# EAGLE board smoothieboard-5driver (EAGLE 6.4), part 1 of 3
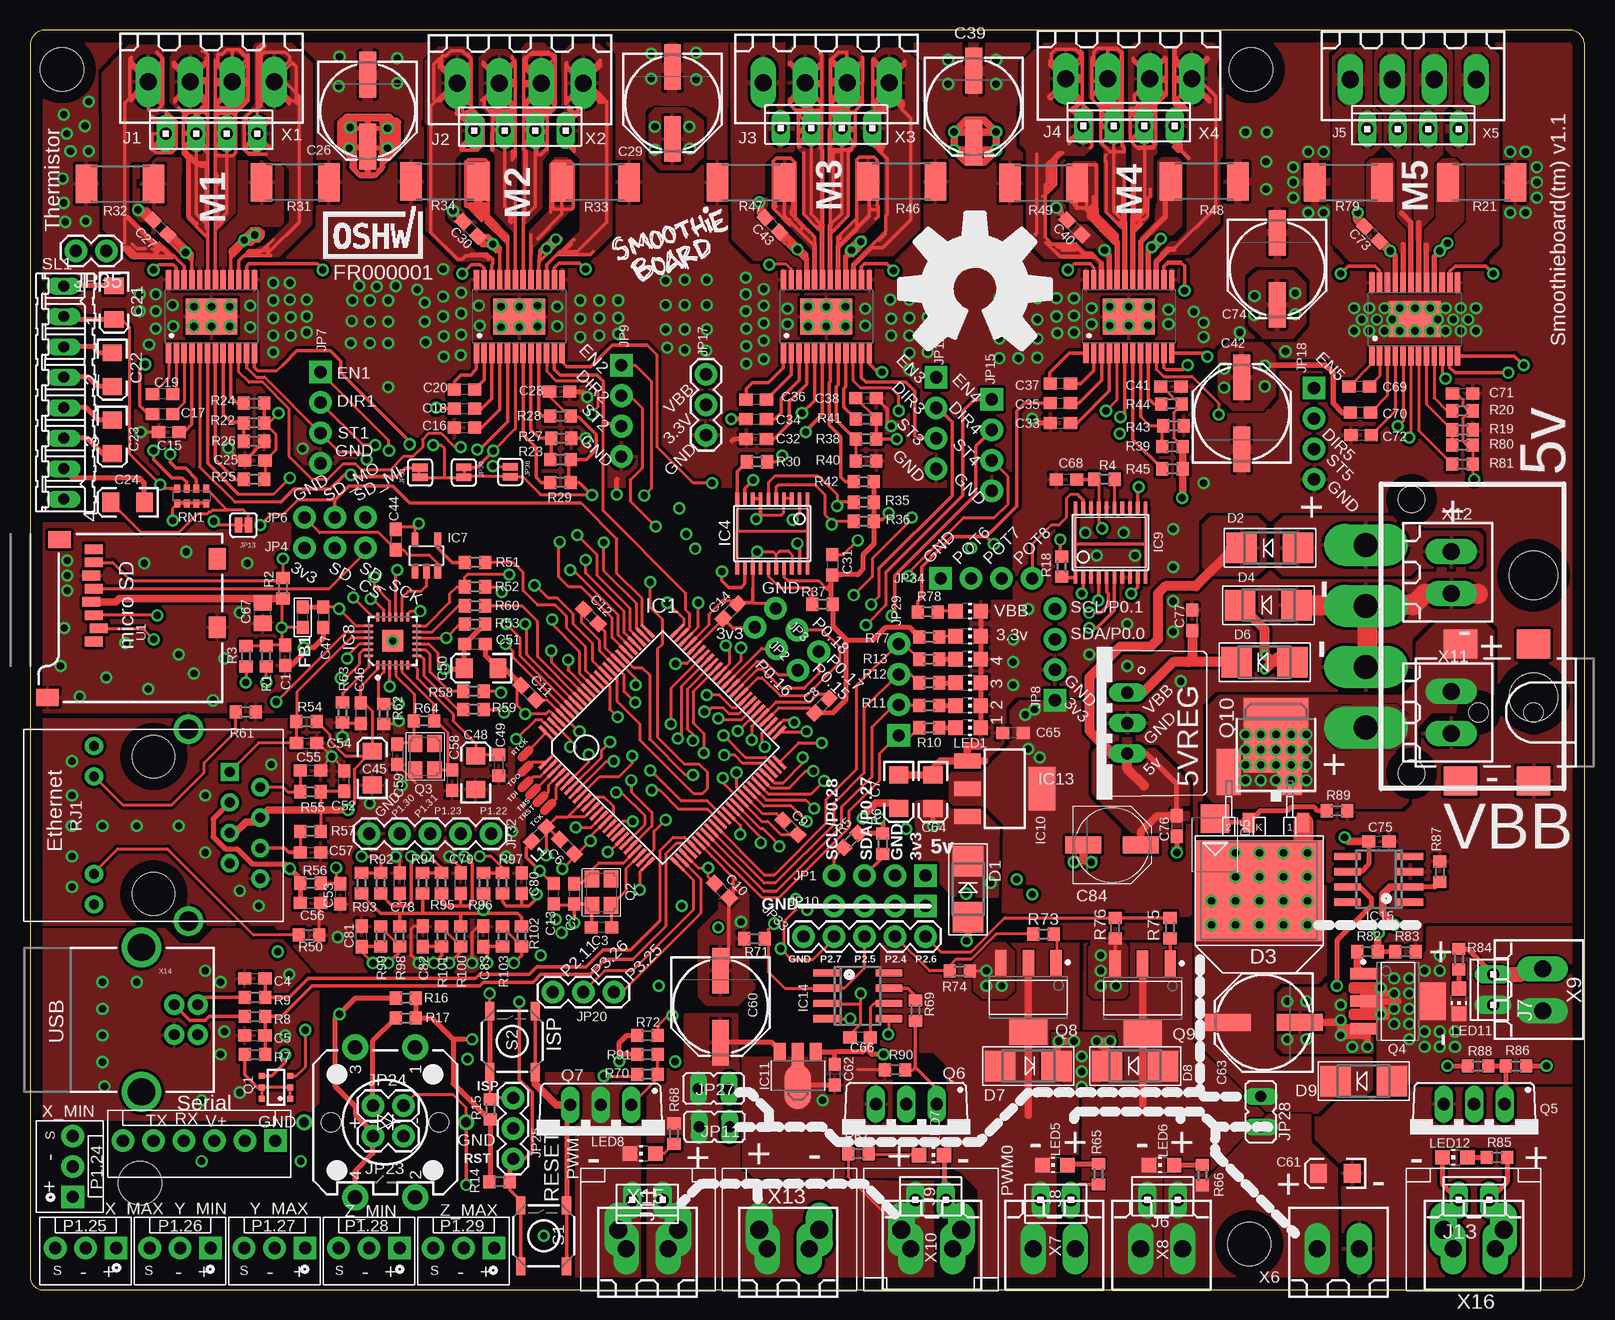
[diagram p4: board, top side]
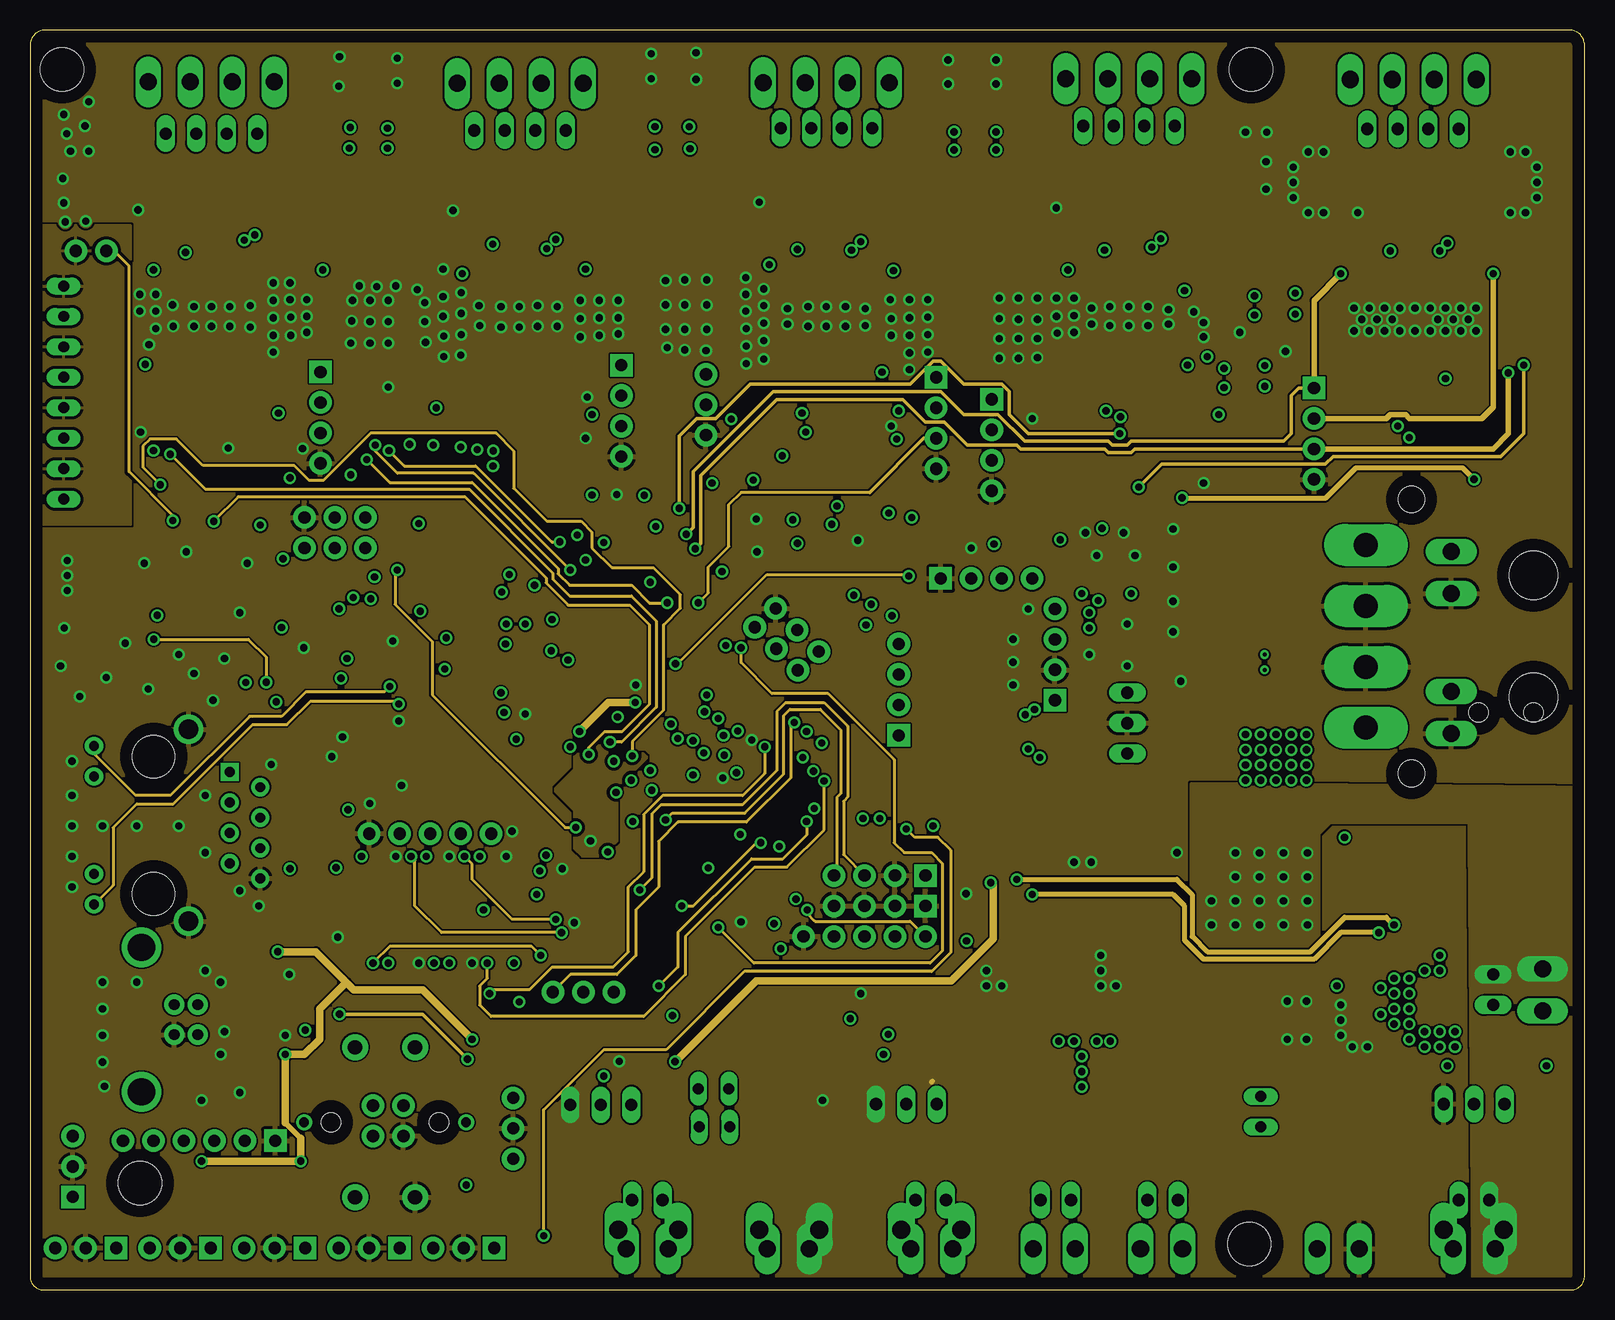
[diagram p5: board, inner layer Route2]
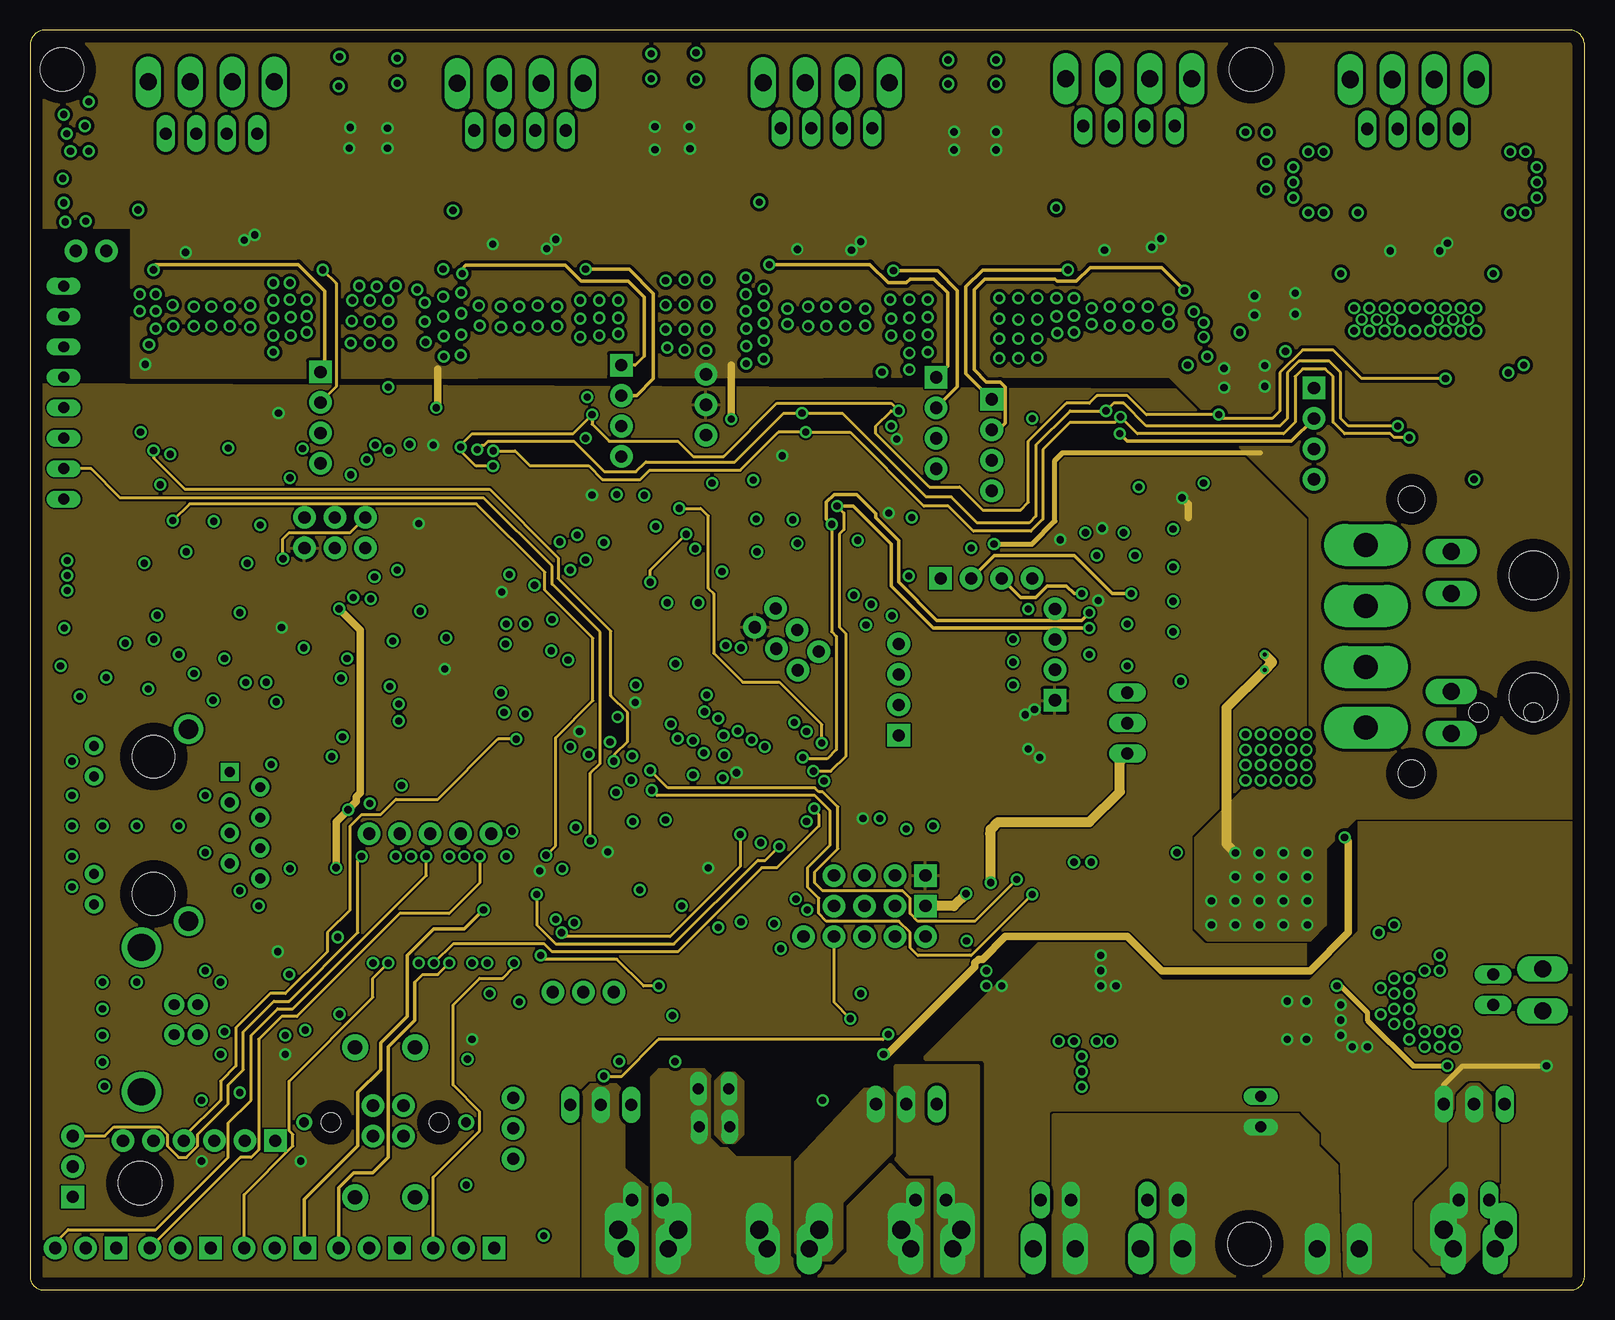
[diagram p6: board, inner layer Route15]
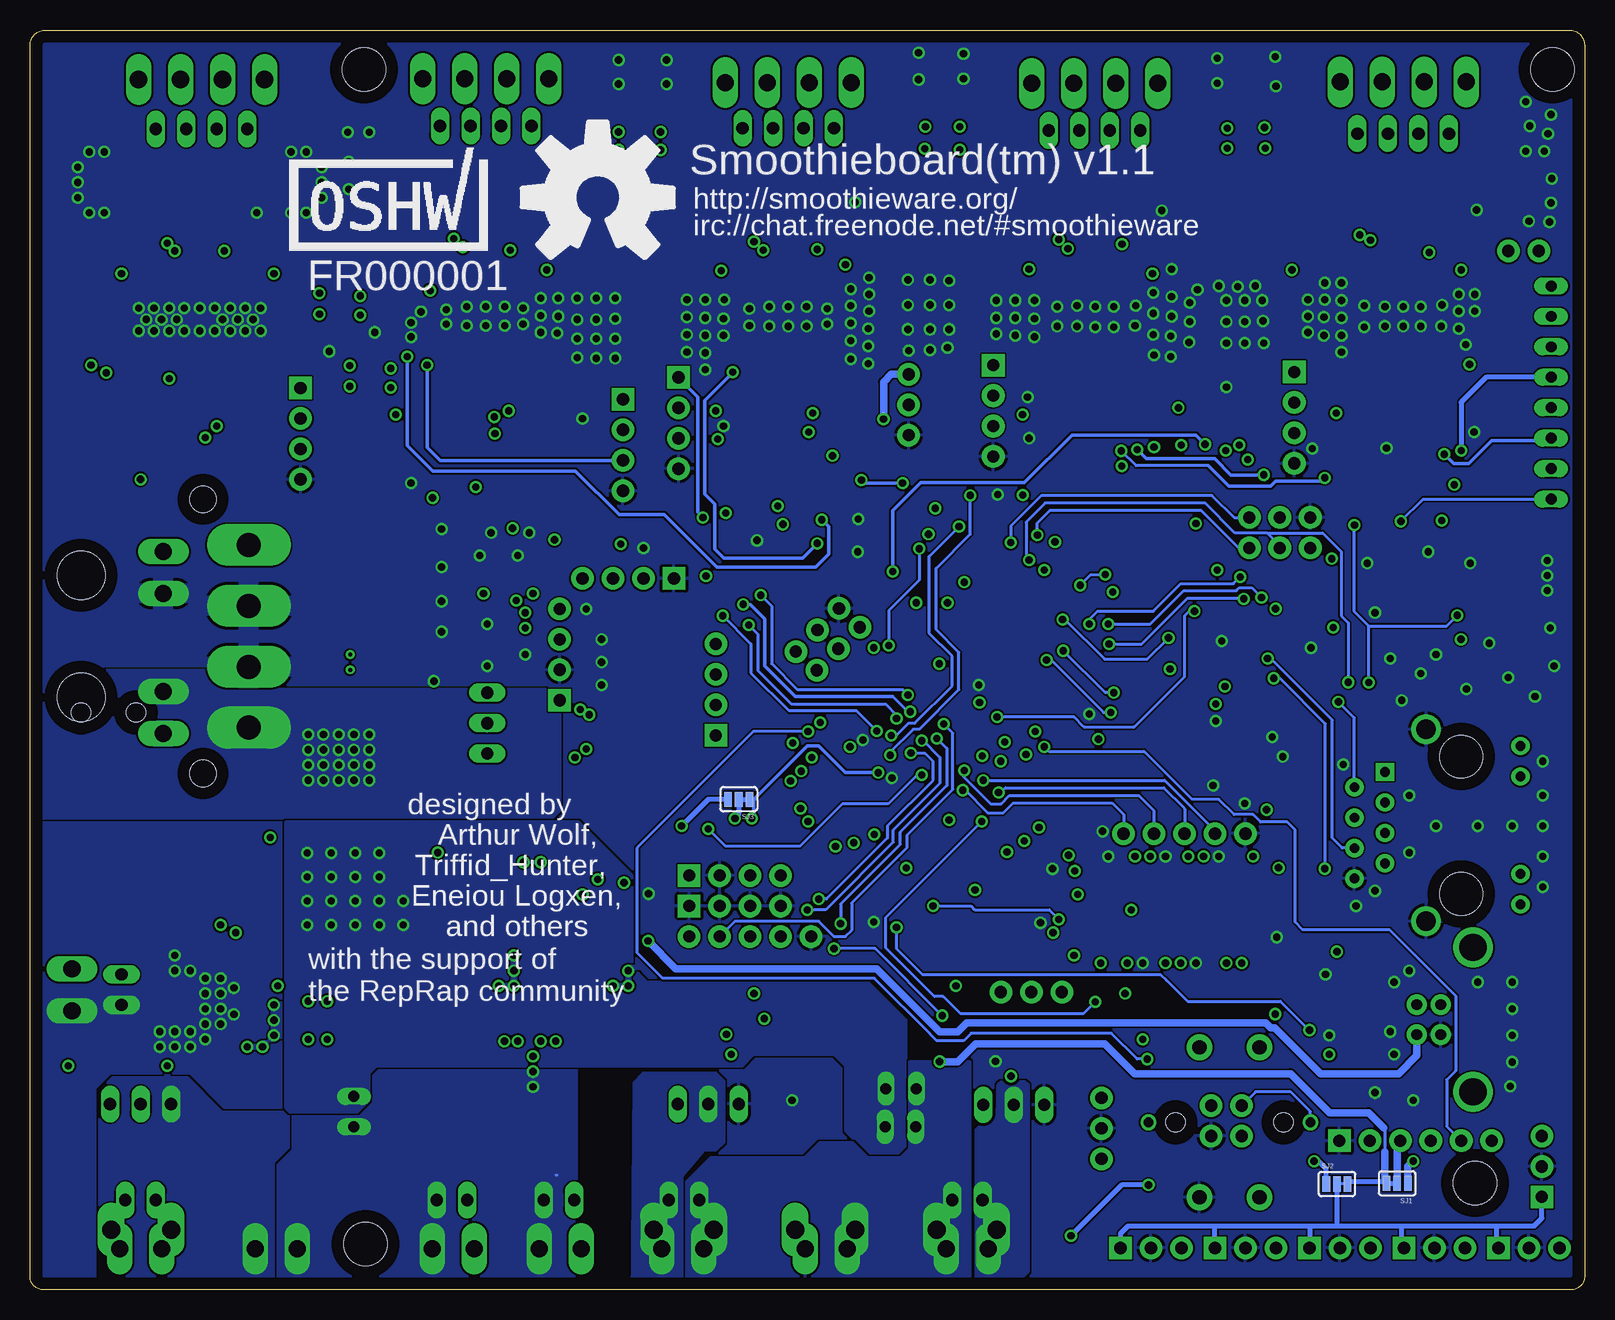
[diagram p7: board, bottom side, seen from below]

Size 129.55 x 105.03 mm. Coordinates in mm from the lower left corner, seen from the top.
Outline: 128.28,105.03 1.28,105.03 arc90 0.01,103.76 0.01,1.27 arc90 1.01,0 128.54,0 arc90 129.55,1.27 129.55,103.76 arc90 128.28,105.03
Copper layers (1*2+15*16): Top 0.035mm / dielectric 0.5mm / Route2 0.035mm / dielectric 0.5mm / Route15 0.035mm / dielectric 0.5mm / Bottom 0.035mm
Design rules "default": minimum track width 10mil, minimum drill 12mil, track to track 6mil, track to pad 6mil, pad to pad 6mil, via to via 6mil, smd to smd 6mil, copper to edge 40mil, drill to drill 8mil, minimum pad ring 10mil, minimum via ring 8mil, stop-mask expansion 0mil, vias tented up to drill 0.61mm, thermal gap 10mil
Holes 3.6 mm at 101.73,101.73 2.67,101.73 9.15,8.89 101.61,3.81
tRestrict: 72 lines

## Footprints (pad centres in the part's own frame; a part is rotated, then mirrored left to right if it is on the bottom)
C0603 = smd 1.1 x 1: 1 -0.85,0; 2 0.85,0
EIA3216 = smd 1.4 x 1.6: A 1.4,0; C -1.4,0
PANASONIC_E = smd 3.8 x 1.4: + 3,0; - -3,0
C0603K = smd 1.05 x 1.08: 1 -0.875,0; 2 0.875,0
C0805 = smd 1.3 x 1.5: 1 -0.85,0; 2 0.85,0
PANASONIC_D = smd 3 x 1.4: + 2.4,0; - -2.4,0
SMADIODE = smd 2.54 x 2.54: A 2.349,0; C -2.349,0
TO263AB = smd 2.032 x 3.81: 1 3.81,2.54; 2 8.89,2.54 | smd 10.668 x 8.382: K 6.35,12.446
SMB = smd 2.4 x 2.4: A 2.2,0; C -2.2,0
0603 = smd 1.1 x 1: 1 -0.85,0; 2 0.85,0
LQFP100 = smd 0.27 x 1.5: 1 -6,-7.75; 2 -5.5,-7.75; 3 -5,-7.75; 4 -4.5,-7.75; 5 -4,-7.75; 6 -3.5,-7.75; 7 -3,-7.75; 8 -2.5,-7.75; 9 -2,-7.75; 10 -1.5,-7.75; 11 -1,-7.75; 12 -0.5,-7.75; 13 0,-7.75; 14 0.5,-7.75; 15 1,-7.75; 16 1.5,-7.75; 17 2,-7.75; 18 2.5,-7.75; 19 3,-7.75; 20 3.5,-7.75; 21 4,-7.75; 22 4.5,-7.75; 23 5,-7.75; 24 5.5,-7.75; 25 6,-7.75; 51 6,7.75; 52 5.5,7.75; 53 5,7.75; 54 4.5,7.75; 55 4,7.75; 56 3.5,7.75; 57 3,7.75; 58 2.5,7.75; 59 2,7.75; 60 1.5,7.75; 61 1,7.75; 62 0.5,7.75; 63 0,7.75; 64 -0.5,7.75; 65 -1,7.75; 66 -1.5,7.75; 67 -2,7.75; 68 -2.5,7.75; 69 -3,7.75; 70 -3.5,7.75; 71 -4,7.75; 72 -4.5,7.75; 73 -5,7.75; 74 -5.5,7.75; 75 -6,7.75 | smd 1.5 x 0.27: 26 7.75,-6; 27 7.75,-5.5; 28 7.75,-5; 29 7.75,-4.5; 30 7.75,-4; 31 7.75,-3.5; 32 7.75,-3; 33 7.75,-2.5; 34 7.75,-2; 35 7.75,-1.5; 36 7.75,-1; 37 7.75,-0.5; 38 7.75,0; 39 7.75,0.5; 40 7.75,1; 41 7.75,1.5; 42 7.75,2; 43 7.75,2.5; 44 7.75,3; 45 7.75,3.5; 46 7.75,4; 47 7.75,4.5; 48 7.75,5; 49 7.75,5.5; 50 7.75,6; 76 -7.75,6; 77 -7.75,5.5; 78 -7.75,5; 79 -7.75,4.5; 80 -7.75,4; 81 -7.75,3.5; 82 -7.75,3; 83 -7.75,2.5; 84 -7.75,2; 85 -7.75,1.5; 86 -7.75,1; 87 -7.75,0.5; 88 -7.75,0; 89 -7.75,-0.5; 90 -7.75,-1; 91 -7.75,-1.5; 92 -7.75,-2; 93 -7.75,-2.5; 94 -7.75,-3; 95 -7.75,-3.5; 96 -7.75,-4; 97 -7.75,-4.5; 98 -7.75,-5; 99 -7.75,-5.5; 100 -7.75,-6
ETSSOP24 = smd 4.32 x 3: EPAD 0,0 | smd 0.45 x 1.65: P01 -3.575,-3.05; P02 -2.925,-3.05; P03 -2.275,-3.05; P04 -1.625,-3.05; P05 -0.975,-3.05; P06 -0.325,-3.05; P07 0.325,-3.05; P08 0.975,-3.05; P09 1.625,-3.05; P10 2.275,-3.05; P11 2.925,-3.05; P12 3.575,-3.05; P13 3.575,3.05; P14 2.925,3.05; P15 2.275,3.05; P16 1.625,3.05; P17 0.975,3.05; P18 0.325,3.05; P19 -0.325,3.05; P20 -0.975,3.05; P21 -1.625,3.05; P22 -2.275,3.05; P23 -2.925,3.05; P24 -3.575,3.05
TSSOP20 = smd 0.305 x 0.991: 1 -2.925,-2.918; 2 -2.275,-2.918; 3 -1.625,-2.918; 4 -0.975,-2.918; 5 -0.325,-2.918; 6 0.325,-2.918; 7 0.975,-2.918; 8 1.625,-2.918; 9 2.275,-2.918; 10 2.925,-2.918; 11 2.925,2.918; 12 2.275,2.918; 13 1.625,2.918; 14 0.975,2.918; 15 0.325,2.918; 16 -0.325,2.918; 17 -0.975,2.918; 18 -1.625,2.918; 19 -2.275,2.918; 20 -2.925,2.918
SOT23-5 = smd 0.55 x 1.2: 1 -0.95,-1.3; 2 0,-1.3; 3 0.95,-1.3; 4 0.95,1.3; 5 -0.95,1.3
QFN24_4MM = smd 0.8 x 0.28: 1 -2,1.25; 2 -2,0.75; 3 -2,0.25; 4 -2,-0.25; 5 -2,-0.75; 6 -2,-1.25; 13 2,-1.25; 14 2,-0.75; 15 2,-0.25; 16 2,0.25; 17 2,0.75; 18 2,1.25 | smd 0.28 x 0.8: 7 -1.25,-2; 8 -0.75,-2; 9 -0.25,-2; 10 0.25,-2; 11 0.75,-2; 12 1.25,-2; 19 1.25,2; 20 0.75,2; 21 0.25,2; 22 -0.25,2; 23 -0.75,2; 24 -1.25,2 | smd 1.778 x 1.778: THERM 0,0
SOT223 = smd 1.219 x 2.235: 1 -2.311,-3.099; 2 0,-3.099; 3 2.311,-3.099 | smd 3.6 x 2.2: 4 0,3.099
SOT89 = smd 1 x 1.5: 1 -1.499,-1.981; 3 1.499,-1.981 | smd 1 x 2: 2 0,-1.727 | smd 2.2 x 3.7: 2@1 0,0.94
R-78 = drill 1.016 long: 1 -2.54,2.54; 2 0,2.54; 3 2.54,2.54
SOIC8 = smd 0.6 x 2.2: 1 -1.905,-2.6; 2 -0.635,-2.6; 3 0.635,-2.6; 4 1.905,-2.6; 5 1.905,2.6; 6 0.635,2.6; 7 -0.635,2.6; 8 -1.905,2.6
10X04MTA = drill 1.016 long: 1 3.81,0; 2 1.27,0; 3 -1.27,0; 4 -3.81,0
10X02MTA = drill 1.016 long: 1 1.27,0; 2 -1.27,0
POWER_JACK_SMD = smd 2.8 x 2.4: GND 0,-5.7; P$4 6.1,-5.7; VIN0 0,5.7; VIN1 6.1,5.7 | hole 1.6: 0,0; 4.572,0
1X04_NO_SILK = drill 1.016 pad 1.88 square: 1 0,0 | drill 1.016 pad 1.88: 2 2.54,0; 3 5.08,0; 4 7.62,0
1X03_NO_SILK = drill 1.016 pad 1.88: 1 0,0; 2 2.54,0; 3 5.08,0
MOLEX-1X6 = drill 1.016 pad 1.88 square: 1 0,0 | drill 1.016 pad 1.88: 2 2.54,0; 3 5.08,0; 4 7.62,0; 5 10.16,0; 6 12.7,0
JP1 = drill 0.914 long: 1 0,-1.27; 2 0,1.27
SJ_2S = smd 0.635 x 1.27: 1 -0.412,0; 2 0.412,0
MOLEX-1X3 = drill 1.016 pad 1.88 square: 1 0,0 | drill 1.016 pad 1.88: 2 2.54,0; 3 5.08,0
1X03 = drill 1.016 pad 1.88: 1 0,0; 2 2.54,0; 3 5.08,0
1X02 = drill 1.016 pad 1.88: 1 0,0; 2 2.54,0
1X05 = drill 1.016 pad 1.88: 1 0,0; 2 2.54,0; 3 5.08,0; 4 7.62,0; 5 10.16,0
CHIP-LED0805 = smd 1.2 x 1.2: A 0,-1.05; C 0,1.05
MOLEX8981 = drill 2 pad 3.5 long: P$1 -1.27,2.54; P$2 -1.27,7.62; P$3 -1.27,12.7; P$4 -1.27,17.78 | hole 2.2: 2.54,21.59; 2.54,-1.27 | hole 4: 12.7,5.08; 12.7,15.24
SC74_INFINEON = smd 0.5 x 0.5: 1 -0.95,-1.2; 2 0,-1.2; 3 0.95,-1.2; 4 0.95,1.2; 5 0,1.2; 6 -0.95,1.2
CRYSTAL_3.2X2.5 = smd 1.4 x 1.2: 1 -1.1,-0.8; 2 1.1,0.8; GND1 -1.1,0.8; GND2 1.1,-0.8
SOT230P700X160-4N = smd 2.15 x 0.95: 1 -2.9,2.3; 2 -2.9,0; 3 -2.9,-2.3 | smd 2.15 x 3.15: 4 2.9,0
TO220BV = drill 1.016 long: D 0,-2.54; G -2.54,-2.54; S 2.54,-2.54
TO252 = smd 1 x 1.6: 1 -2.28,-4.8; 2 2.28,-4.8 | smd 5.4 x 6.2: 3 0,2.5
R0603 = smd 1 x 1.1: 1 -0.85,0; 2 0.85,0
R2512 = smd 1.8 x 3.2: 1 -2.8,0; 2 2.8,0
HR911105A = drill 0.813 pad 1.524: G+ 4.953,-6.604; G- 4.953,-4.064; GND -8.89,4.445; NC -6.35,3.175; P4 -8.89,-0.635; P5 -6.35,0.635; RD+ -6.35,-1.905; RD- -8.89,1.905; TD- -8.89,-3.175; Y+ 4.953,6.604; Y- 4.953,4.064 | drill 1.651 pad 2.159: SHIELD0 -2.921,8.001; SHIELD1 -2.921,-8.001 | drill 0.813 pad 1.524 square: TD+ -6.35,-4.445 | hole 3.556: 0,-5.715; 0,5.715
0603-ARV = smd 0.5 x 0.65: 1 -1.2,-0.625; 2 -0.4,-0.625; 3 0.4,-0.625; 4 1.2,-0.625; 5 1.2,0.625; 6 0.4,0.625; 7 -0.4,0.625; 8 -1.2,0.625
TACTILE_SWITCH_SMD = smd 1.524 x 0.762: 1 -2.54,1.905; 2 2.54,1.905; 3 -2.54,-1.905; 4 2.54,-1.905
TACTILE-PTH-LED-12MM = drill 1.2 pad 2.159: 1 -6.25,2.5; 2 6.25,2.5; 3 -6.25,-2.5; 4 6.25,-2.5 | drill 0.8: A 0,6.75; C 0,-6.75 | hole 1.6: 0,4.5; 0,-4.5
SJ_3 = smd 0.635 x 1.27: 1 -0.889,0; 2 0,0; 3 0.889,0
08P = drill 0.914 long: 1 -8.89,0; 2 -6.35,0; 3 -3.81,0; 4 -1.27,0; 5 1.27,0; 6 3.81,0; 7 6.35,0; 8 8.89,0
MICRO-SD-SOCKET-PP = smd 0.8 x 1.5: 1 -8.94,10.7; 2 -7.84,10.3; 3 -6.74,10.7; 4 -5.64,10.9; 5 -4.54,10.7; 6 -3.44,10.9; 7 -2.34,10.7; 8 -1.24,10.7 | smd 1.8 x 1.4: CD1 -2.05,0.4; CD2 -7.75,0.4 | smd 1.4 x 1.9: GND1 -13.6,14.55; GND3 -0.45,13.55
1715250000 = drill 1.5 long: P$1 0,0; P$2 5,0
180G-4 = drill 1.422 long: 1 -5.25,0; 2 -1.75,0; 3 1.75,0; 4 5.25,0
180G-2 = drill 1.422 long: 1 -1.75,0; 2 1.75,0
USB-B-PTH = drill 0.914 pad 1.676: D+ 0,1.25; D- 1.981,1.25; GND 0,-1.25; VBUS 1.981,-1.25 | drill 2.286: S1 -2.718,-6.02; S2 -2.718,6.02

## Placement (x,y rotation side)
C1  .1uF  [C0603]  21.28,52.9 90 top
C2  12pF  [C0603]  45.35,33.02 270 top
C3  12pF  [C0603]  47.63,30.23 180 top
C4  18pF  [C0603]  18.74,25.97 0 top
C5  18pF  [C0603]  18.74,21.21 0 top
C6  .1uF  [C0603]  44.75,36.94 315 top
C7  10uF  [EIA3216]  72.4,41.53 270 top
C8  .1uF  [C0603]  65.98,48.7 225 top
C9  .1uF  [C0603]  63.38,38.54 135 top
C10  .1uF  [C0603]  57.67,33.27 135 top
C11  .1uF  [C0603]  41.54,49.78 315 top
C12  .1uF  [C0603]  46.74,56.13 135 top
C13  .1uF  [C0603]  43.64,33.03 90 top
C14  .1uF  [C0603]  58.36,56.58 225 top
C15  .22uF  [C0603]  11.56,71.5 0 top
C16  .22uF  [C0603]  36.2,71.88 0 top
C17  .1uF  [C0603]  11.06,73.02 0 top
C18  .1uF  [C0603]  36.2,73.47 0 top
C19  .1uF  [C0603]  11.06,74.68 180 top
C20  .1uF  [C0603]  36.2,75.06 180 top
C21  10uF  [EIA3216]  6.99,82.3 270 top
C22  10uF  [EIA3216]  6.87,76.71 270 top
C23  10uF  [EIA3216]  6.87,71.12 270 top
C24  10uF  [EIA3216]  8.14,65.66 180 top
C25  .1uF  [C0603]  18.74,69.15 180 top
C26  100uF  [PANASONIC_E]  28.14,98.3 270 top
C27  .1uF  [C0603]  10.87,88.58 135 top
C28  .1uF  [C0603]  44.14,74.87 0 top
C29  100uF  [PANASONIC_E]  53.54,98.93 270 top
C30  .1uF  [C0603]  36.71,88.46 135 top
C31  .1uF  [C0603]  66.87,60.45 270 top
C32  .22uF  [C0603]  60.52,70.93 0 top
C33  .22uF  [C0603]  85.86,72.26 0 top
C34  .1uF  [C0603]  60.52,72.58 0 top
C35  .1uF  [C0603]  85.86,73.91 0 top
C36  .1uF  [C0603]  60.52,74.23 180 top
C37  .1uF  [C0603]  85.86,75.56 180 top
C38  .1uF  [C0603]  69.67,74.36 0 top
C39  100uF  [PANASONIC_E]  78.65,98.63 270 top
C40  .1uF  [C0603]  87.05,88.56 135 top
C41  .1uF  [C0603]  95.07,75.31 0 top
C42  100uF  [PANASONIC_E]  100.98,73.08 90 top
C43  .1uF  [C0603]  61.86,88.77 135 top
C44  .1uF  [C0603]  30.49,62.55 270 top
C45  10uF  [EIA3216]  28.52,43.5 90 top
C46  .1uF  [C0603]  27.57,48.07 270 top
C47  .1uF  [C0603]  24.46,56.07 270 top
C48  1uF  [EIA3216]  37.16,43.12 90 top
C49  470pF  [C0603K]  39.06,43.75 270 top
C50  10uF  [EIA3216]  37.6,51.82 180 top
C51  .1uF  [C0603]  37.09,53.85 0 top
C52  .1uF  [C0603]  26.17,42.42 90 top
C53  .1uF  [C0603]  25.85,33.02 270 top
C54  18pF  [C0603]  23.06,45.59 0 top
C55  18pF  [C0603]  23.38,43.31 0 top
C56  18pF  [C0603]  23.38,32.26 0 top
C57  18pF  [C0603]  23.38,36.45 0 top
C58  12pF  [C0603]  35.19,42.48 270 top
C59  12pF  [C0603]  30.61,44.64 270 top
C60  100uF  [PANASONIC_E]  57.54,23.62 270 top
C61  10uF  [EIA3216]  108.78,9.72 180 top
C62  .1uF  [C0603]  67.06,17.94 270 top
C63  100uF  [PANASONIC_E]  102.81,22.29 180 top
C64  10uF  [EIA3216]  75.26,41.53 270 top
C65  .1uF  [C0603]  81.92,46.44 180 top
C66  .1uF  [C0603]  69.18,21.06 180 top
C67  1uF  [C0805]  19.41,56.43 90 top
C68  .1uF  [C0603]  86.37,67.56 0 top
C69  .1uF  [C0603]  110.77,75.31 180 top
C70  .1uF  [C0603]  110.86,73.15 0 top
C71  .1uF  [C0603]  119.39,74.71 0 top
C72  .22uF  [C0603]  110.93,71.25 0 top
C73  .1uF  [C0603]  111.84,88.03 135 top
C74  100uF  [PANASONIC_E]  103.93,85.12 270 top
C75  .1uF  [C0603]  112.4,37.4 0 top
C76  .1uF  [C0603]  95.58,38.67 270 top
C77  .33uF  [C0603]  96.85,55.82 90 top
C78  .1uF  [C0603]  30.81,33.91 90 top
C79  .1uF  [C0603]  35.89,33.91 90 top
C80  .1uF  [C0603]  40.97,33.91 90 top
C81  .1uF  [C0603]  27.63,29.46 90 top
C82  .1uF  [C0603]  32.71,29.46 90 top
C83  .1uF  [C0603]  37.79,29.46 90 top
C84  100uF  [PANASONIC_D]  90.18,37.08 0 top
D1  MBRA210LT3  [SMADIODE]  78.18,33.4 270 top
D2  MBRA210LT3  [SMADIODE]  103.32,61.85 0 top
D3  VS-25CTQ045S  [TO263AB]  108.78,45.72 180 top
D4  B1100-13-F  [SMADIODE]  103.2,57.09 0 top
D5  15v  [SMB]  98.75,37.08 90 top
D6  MBRA210LT3  [SMADIODE]  102.88,52.32 0 top
D7  MBRA210LT3  [SMADIODE]  83.19,18.67 180 top
D8  MBRA210LT3  [SMADIODE]  92.08,18.67 0 top
D9  MBRA210LT3  [SMADIODE]  111.13,17.4 0 top
FB1  [0603]  22.74,56.07 90 top
IC1  LPC1769  [LQFP100]  52.71,45.21 315 top
IC2  A5984  [ETSSOP24]  15.12,81.15 0 top
IC3  A5984  [ETSSOP24]  40.77,81.15 0 top
IC4  MCP44X1  [TSSOP20]  61.86,63.06 180 top
IC5  A5984  [ETSSOP24]  66.37,81.15 0 top
IC6  A5984  [ETSSOP24]  91.57,81.15 0 top
IC7  [SOT23-5]  33.03,61.21 0 top
IC8  [QFN24_4MM]  30.23,54.1 90 top
IC9  MCP44X1  [TSSOP20]  90.04,62.31 0 top
IC10  LM1117-3.3V  [SOT223]  81.22,41.78 270 top
IC11  78L12F  [SOT89]  63.99,17.86 180 top
IC12  A5984  [ETSSOP24]  115.4,80.91 0 top
IC13  R-78E-5.0  [R-78]  88.91,47.24 270 top
IC14  TC4427  [SOIC8]  68.97,24.51 270 top
IC15  TC4427  [SOIC8]  112.4,34.23 90 top
J1  [10X04MTA]  15.12,96.39 0 top
J2  [10X04MTA]  40.84,96.65 0 top
J3  [10X04MTA]  66.37,96.84 0 top
J4  [10X04MTA]  91.57,97.03 0 top
J5  [10X04MTA]  115.26,96.77 0 top
J6  [10X02MTA]  94.39,7.49 0 top
J7  [10X02MTA]  121.93,25.02 90 top
J8  [10X02MTA]  85.48,7.49 180 top
J9  [10X02MTA]  75.06,7.49 0 top
J10  POWER_JACKSMD  [POWER_JACK_SMD]  125.29,48.13 180 top
J11  [10X02MTA]  51.44,7.49 180 top
J13  [10X02MTA]  120.34,7.49 0 top
JP1  [1X04_NO_SILK]  74.62,34.54 180 top
JP2  [1X03_NO_SILK]  60.4,55.25 315 top
JP3  [1X03_NO_SILK]  65.73,53.21 135 top
JP4  [1X03_NO_SILK]  22.87,61.85 0 top
JP5  [MOLEX-1X6]  20.44,12.43 180 top
JP6  [1X03_NO_SILK]  27.95,64.39 180 top
JP7  [1X04_NO_SILK]  24.2,76.52 270 top
JP8  [1X04_NO_SILK]  85.42,49.15 90 top
JP9  [1X04_NO_SILK]  49.28,77.09 270 top
JP10  [1X04_NO_SILK]  74.62,32 180 top
JP11  [JP1]  57.03,13.59 270 top
JP12  [1X04_NO_SILK]  75.51,76.07 270 top
JP13  [SJ_2S]  17.79,63.75 0 top
JP14  [MOLEX-1X3]  7.18,3.49 180 top
JP15  [1X04_NO_SILK]  80.14,74.23 270 top
JP16  [MOLEX-1X3]  15.06,3.49 180 top
JP17  [1X03]  56.33,76.33 270 top
JP18  [1X04_NO_SILK]  107.01,75.18 270 top
JP19  [MOLEX-1X3]  22.93,3.49 180 top
JP20  [1X03]  48.65,24.83 180 top
JP21  [MOLEX-1X3]  30.81,3.49 180 top
JP22  [MOLEX-1X3]  38.68,3.49 180 top
JP23  [1X02]  28.58,12.83 0 top
JP24  [1X02]  28.58,15.37 0 top
JP25  [1X03]  40.27,10.92 90 top
JP26  [MOLEX-1X3]  3.56,7.75 90 top
JP27  [JP1]  56.97,16.76 270 top
JP28  [JP1]  102.56,14.86 0 top
JP29  [1X04_NO_SILK]  72.4,46.23 90 top
JP30  [SJ_2S]  36.15,68.15 270 top
JP31  [SJ_2S]  32.51,68.14 90 top
JP32  [1X05]  38.43,38.04 180 top
JP33  [1X05]  74.62,29.46 180 top
JP34  [1X04_NO_SILK]  75.89,59.31 0 top
JP35  [1X02]  6.36,86.61 180 top
JP36  [SJ_2S]  40.01,68.2 270 top
L1  [0603]  42.43,37.97 225 top
LED1  [CHIP-LED0805]  78.18,46.86 270 top
LED2  [CHIP-LED0805]  78.18,48.7 270 top
LED3  [CHIP-LED0805]  78.18,50.61 270 top
LED4  [CHIP-LED0805]  78.18,52.58 270 top
LED5  [CHIP-LED0805]  85.42,10.41 90 top
LED6  [CHIP-LED0805]  94.31,10.41 90 top
LED7  [CHIP-LED0805]  75.13,11.24 270 top
LED8  [CHIP-LED0805]  51.06,11.37 90 top
LED9  [CHIP-LED0805]  78.18,54.48 270 top
LED10  [CHIP-LED0805]  78.18,56.58 270 top
LED11  [CHIP-LED0805]  119.07,24.07 180 top
LED12  [CHIP-LED0805]  118.75,11.05 90 top
POWER  POWER  [MOLEX8981]  112.59,44.32 0 top
Q1  BSL207SP  [SC74_INFINEON]  20.51,16.89 90 top
Q2  12MHz  [CRYSTAL_3.2X2.5]  47.63,33.15 90 top
Q3  25MHz  [CRYSTAL_3.2X2.5]  32.9,44.45 270 top
Q4  ZXMN4A06  [SOT230P700X160-4N]  113.99,24.07 0 top
Q5  AOT240L  [TO220BV]  120.34,12.95 180 top
Q6  AOT240L  [TO220BV]  73.03,12.95 180 top
Q7  AOT240L  [TO220BV]  47.57,12.89 180 top
Q8  ZXMN4A06  [SOT230P700X160-4N]  83.19,24.38 270 top
Q9  ZXMN4A06  [SOT230P700X160-4N]  92.72,24.32 270 top
Q10  SUD50P04-08-GE3  [TO252]  103.83,43.75 0 top
R1  10K  [R0603]  19.68,52.81 90 top
R2  10K  [R0603]  21.08,58.5 270 top
R3  10K  [R0603]  18,52.81 90 top
R4  100K  [R0603]  89.54,67.56 180 top
R5  2.2k  [R0603]  68.4,37.46 45 top
R6  2.2k  [R0603]  71.06,37.21 90 top
R7  1.5K  [R0603]  18.74,19.62 180 top
R8  33R  [R0603]  18.74,22.8 0 top
R9  33R  [R0603]  18.74,24.38 0 top
R10  1k  [R0603]  74.94,46.86 180 top
R11  1k  [R0603]  74.94,48.7 180 top
R12  1k  [R0603]  74.94,50.61 180 top
R13  1k  [R0603]  74.94,52.58 180 top
R14  10K  [R0603]  39.12,9.02 180 top
R15  10K  [R0603]  38.36,15.05 270 top
R16  10K  [R0603]  31.31,24.32 0 top
R17  330R  [R0603]  31.31,22.67 180 top
R18  33K  [R0603]  85.98,60.3 90 top
R19  10K  [R0603]  119.39,71.69 0 top
R20  10K  [R0603]  119.39,73.28 0 top
R21  0.05R  [R2512]  120.98,92.33 180 top
R22  NP  [R0603]  18.68,72.26 180 top
R23  NP  [R0603]  44.2,69.21 0 top
R24  10K  [R0603]  18.68,73.91 0 top
R25  10K  [R0603]  18.68,67.56 0 top
R26  10K  [R0603]  18.68,70.74 0 top
R27  10K  [R0603]  44.27,70.99 0 top
R28  10K  [R0603]  44.2,72.83 0 top
R29  10K  [R0603]  44.2,67.31 0 top
R30  33K  [R0603]  60.59,69.02 0 top
R31  0.05R  [R2512]  22.11,92.33 180 top
R32  0.05R  [R2512]  7.5,92.2 0 top
R33  0.05R  [R2512]  47.12,92.33 180 top
R34  0.05R  [R2512]  34.55,92.39 0 top
R35  2.2k  [R0603]  69.48,65.66 0 top
R36  2.2k  [R0603]  69.48,64.07 0 top
R37  100K  [R0603]  66.05,57.15 0 top
R38  NP  [R0603]  69.67,70.93 0 top
R39  NP  [R0603]  95.19,70.29 0 top
R40  10K  [R0603]  69.67,69.09 0 top
R41  10K  [R0603]  69.67,72.58 0 top
R42  10K  [R0603]  69.48,67.37 0 top
R43  10K  [R0603]  95.31,72.03 0 top
R44  10K  [R0603]  95.13,73.85 0 top
R45  10K  [R0603]  95.19,68.45 0 top
R46  0.05R  [R2512]  72.65,92.39 180 top
R47  0.05R  [R2512]  60.08,92.33 0 top
R48  0.05R  [R2512]  97.86,92.39 180 top
R49  0.05R  [R2512]  84.46,92.27 0 top
R50  330R  [R0603]  23.25,29.59 180 top
R51  22R  [R0603]  37.09,60.64 0 top
R52  1.5K  [R0603]  37.09,58.61 0 top
R53  10K  [R0603]  37.09,55.5 0 top
R54  49.9R  [R0603]  23.06,47.37 180 top
R55  49.9R  [R0603]  23.38,41.53 180 top
R56  49.9R  [R0603]  23.38,33.91 180 top
R57  49.9R  [R0603]  23.38,38.23 180 top
R58  22R  [R0603]  36.96,49.91 0 top
R59  22R  [R0603]  36.96,48.39 0 top
R60  22R  [R0603]  37.09,57.02 0 top
R61  330R  [R0603]  17.98,48.18 180 top
R62  10K  [R0603]  29.47,48.01 90 top
R63  12.1K  [R0603]  26.04,48.13 90 top
R64  1M  [R0603]  32.84,47.43 180 top
R65  8.2K  [R0603]  89.03,9.65 90 top
R66  8.2K  [R0603]  97.69,9.56 90 top
R67  8.2K  [R0603]  69.03,11.37 0 top
R68  8.2K  [R0603]  53.67,13.02 270 top
R69  22R  [R0603]  73.78,23.29 270 top
R70  22R  [R0603]  51.44,17.97 0 top
R71  10k  [R0603]  60.36,29.28 0 top
R72  10k  [R0603]  51.44,21.21 0 top
R73  22R  [R0603]  84.46,29.65 180 top
R74  10k  [R0603]  77.48,26.59 0 top
R75  22R  [R0603]  95,30.16 90 top
R76  10k  [R0603]  90.43,30.16 270 top
R77  1k  [R0603]  74.94,54.42 180 top
R78  8.2K  [R0603]  74.81,56.52 180 top
R79  0.05R  [R2512]  109.86,92.33 0 top
R80  NP  [R0603]  119.39,70.42 0 top
R81  10K  [R0603]  119.39,68.83 0 top
R82  22R  [R0603]  111.45,28.19 0 top
R83  10k  [R0603]  114.63,28.19 0 top
R84  8.2K  [R0603]  119.07,27.56 270 top
R85  8.2K  [R0603]  122.25,11.05 180 top
R86  10k  [R0603]  123.83,18.67 0 top
R87  10k  [R0603]  117.48,34.86 270 top
R88  22R  [R0603]  120.66,18.67 180 top
R89  10k  [R0603]  108.91,39.94 0 top
R90  10k  [R0603]  72.08,18.35 180 top
R91  10k  [R0603]  51.44,19.62 180 top
R92  5k6  [R0603]  29.22,33.91 270 top
R93  1k  [R0603]  27.63,33.91 270 top
R94  1k  [R0603]  32.71,33.91 270 top
R95  5k6  [R0603]  34.3,33.91 270 top
R96  1k  [R0603]  37.79,33.91 270 top
R97  5k6  [R0603]  39.38,33.91 270 top
R98  1k  [R0603]  30.81,29.46 90 top
R99  5k6  [R0603]  29.22,29.46 270 top
R100  1k  [R0603]  35.89,29.46 90 top
R101  5k6  [R0603]  34.3,29.46 270 top
R102  1k  [R0603]  40.97,29.46 90 top
R103  5k6  [R0603]  39.38,29.46 270 top
RJ1  HR911105A  [HR911105A]  10.29,38.73 180 top
RN1  4.7K  [0603-ARV]  13.47,66.17 0 top
S1  [TACTILE_SWITCH_SMD]  42.81,4.51 90 top
S2  [TACTILE_SWITCH_SMD]  40.2,20.7 90 top
S3  SWITCH-MOMENTARY-LEDPTH  [TACTILE-PTH-LED-12MM]  29.6,13.97 270 top
SJ1  [SJ_3]  15.62,8.87 180 bottom
SJ2  [SJ_3]  20.65,8.83 0 bottom
SJ3  [SJ_3]  70.49,40.89 180 bottom
SL1  [08P]  2.8,74.8 270 top
U1  USD-SOCKETNEW  [MICRO-SD-SOCKET-PP]  16.01,62.99 90 top
U$5  5MMCONN  [1715250000]  60.79,5.03 0 top
U$6  5MMCONN  [1715250000]  49.01,5.03 0 top
U$7  5MMCONN  [1715250000]  117.8,5.03 0 top
U$8  OSHW-LOGOH  [OSHW-LOGO-HUGE]  78.75,83.44 0 top
U$9  OSHW-LOGOH  [OSHW-LOGO-HUGE]  82.24,91.06 0 bottom
U$10  5MMCONN  [1715250000]  77.59,5.03 180 top
U$11  FR000001  [CERT-SMALL-SILK]  28.58,85.98 0 top
U$12  FR000001  [CERT-MED-SILK]  99.7,86.61 0 bottom
X1  [180G-4]  15.12,100.71 180 top
X2  [180G-4]  40.84,100.58 180 top
X3  [180G-4]  66.37,100.65 180 top
X4  [180G-4]  91.57,100.96 180 top
X5  [180G-4]  115.26,100.9 180 top
X6  [180G-2]  109.04,3.43 0 top
X7  [180G-2]  85.35,3.43 180 top
X8  [180G-2]  94.29,3.43 180 top
X9  [180G-2]  126.06,25.02 270 top
X10  [180G-2]  75.16,3.43 180 top
X11  [180G-2]  118.44,48.13 270 top
X12  [180G-2]  118.44,59.82 270 top
X13  [180G-2]  63.19,3.43 0 top
X14  USBPTH  [USB-B-PTH]  12.01,22.53 0 top
X15  [180G-2]  51.44,3.43 0 top
X16  [180G-2]  120.34,3.43 180 top

## Tracks (layer width: path | path; a pad name or v marks a point on that pad's centre or on a via)
3.3V  (via drill 0.6)
  Top 0.254: IC8.9 33.21,53.85 33.98,53.09 33.98,52.26 34.49,51.75 v34.55,51.75 | 66.49,58.48 66.37,58.48 65.73,59.12 63.13,59.12 62.83,59.41 IC4.17 | 66.75,59.48 C31.2 66.87,59.63 | C12.2 45.98,56.57 45.98,55.63 47.44,54.17 47.44,53.31 IC1.84 49.51,51.25 49.51,49.88 v50.43,48.96 | R52.2 38.87,58.61 v39.31,58.17 | 32.11,62.55 32.11,63.6 | 32.11,63.6 v32.39,63.88 | 36.27,51.75 36.26,51.75 C50.A | R53.2 37.85,55.5 | R28.2 45.03,72.81 45.03,72.77 43.29,74.51 C28.1 43.05,75.11 | R29.2 45.03,67.31 | 62.81,39.12 C9.2 62.24,39.69 61.07,39.69 IC1.42 58.87,41.88 v58.87,43.12 | 57.79,55.94 57.79,55.95 C14.2 57.76,55.92 IC1.71 | R14.2 38.25,9.04 | C10.2 56.52,34.42 v56.52,35.18 55.67,35.18 IC1.28 | v48.14,36.51 48.26,36.51 IC1.19 | FB1.1 v20.96,55.22 | R2.2 20.96,57.53 v20.96,55.22 | R3.2 R1.2 19.76,53.75 C1.2 20.96,54.06 v20.96,55.22 | R41.2 70.52,72.66 C38.1 | 32.11,63.6 30.69,63.6 C44.1 | v20.71,73.09 19.88,72.26 R22.1 20.51,71.28 20.51,70.07 C25.1 19.59,67.63 R25.2 | JP31.1 34.51,67.72 | 34.51,67.72 36.14,67.72 JP30.2 36.2,67.79 JP36.2 41.06,67.79 42.55,66.29 46.81,66.29 v46.83,66.27 | 34.51,67.72 34.51,70.17 34.25,70.43 v33.61,70.43 | v62.68,69.53 62.17,69.02 R30.2 | R44.2 95.98,73.86 95.78,73.86 94.34,75.31 C41.1 | v42.49,34.93 43.54,33.88 C13.2 | 96.04,73.79 95.97,73.79 95.31,73.13 95.31,71.03 R39.2 | 120.24,73.18 120.02,73.18 119.92,73.18 119.39,72.64 119.39,70.74 119.71,70.42 R80.2 R81.2 120.24,67.67 v120.34,67.56 | R4.2 89.07,67.19 IC9.17 89.07,63.76 v89.34,63.49 | C11.2 43.08,49.18 IC1.96 45.72,46.55 v45.79,46.55 | IC1.54 62.38,48.51 64.97,48.51 C8.2 | C71.1 118.91,74.71 119.39,74.23 119.39,73.75 119.86,73.28 R20.2
  Top 0.305: R41.2 R38.2 v72.24,70.93 | R22.1 R24.2 19.5,73.94 | 32.11,62.55 IC7.5 | 57.79,55.94 58.55,55.18 60.33,55.18 JP2.1 | 45.03,72.77 45.73,72.77 47.19,71.31 47.19,70.04 46.36,69.21 R23.2 44.9,69.21 44.9,67.44 45.03,67.31 | R29.2 45.79,67.31 v46.83,66.27 | 66.43,58.48 66.37,58.48 66.68,58.8 66.75,58.8 66.68,58.74 66.68,58.23 66.43,58.48 | 66.43,58.48 66.62,58.48 66.75,58.36 66.75,57.02 66.87,56.9 66.87,55.44 | R42.2 70.33,65.49 70.3,65.47 70.3,64.26 70.37,64.2 71,64.2 v71.57,64.77 | L1.2 41.82,37.31 41.35,36.83 41.35,36.07 v42.49,34.93 | C68.2 R4.2 | IC9.4 89.07,57.5 v89.02,57.46 | Q1.4 20.14,17.84 21.28,18.99 v21.28,19.62 | v85.85,62.54 85.85,61.28 R18.2 | R20.2 120.13,73.28 120.02,73.18
  Top 0.406: v34.55,51.75 36.27,51.75 | R42.2 R35.2 R36.2 70.33,62.19 69.41,61.28 69.41,60.07 68.97,59.63 67.44,59.63 67.38,59.56 66.94,59.56 66.87,59.63 | 66.75,59.48 66.75,58.8 66.75,58.48 | 66.75,58.48 66.75,58.36 66.75,57.3 R37.2 66.9,55.35 68.08,54.17 | 66.49,58.48 66.75,58.48 | 67.63,59.63 66.9,59.63 C31.2 | 35.25,20.89 35.25,17.21 38.26,14.2 R15.2 38.36,9.14 38.25,9.04 38.23,9.02 38.23,8.95 | 68.08,54.17 68.02,54.1 68.02,49.21 66.91,48.1 C8.2 | 68.08,54.17 70.24,54.17 71.32,55.25 73.26,55.25 R77.2 | C50.A 36.2,53.81 C51.1 37.85,55.46 37.85,55.5 | v36.84,20.89 35.25,20.89 | 35.25,20.89 33.47,22.67 R17.1 R16.2
  Top 0.61: U1.4 7.13,57.35 7.43,57.65 19.51,57.65 | 19.51,57.65 R2.2 | C67.2 19.41,57.55 19.51,57.65 | R44.2 96.04,73.79 | R39.2 R45.2 96.04,66.07 v96.01,66.03 | v69.41,39.31 69.41,39.49 70.05,40.13 70.49,40.58 71.95,40.58 C7.A
  Top 1.016: IC10.4 84.4,41.78 84.53,41.66 84.46,41.66 84.21,41.91 84.65,41.91
  Route2 0.406: v120.34,67.56 119.39,68.52 110.5,68.52 107.96,65.98 96.06,65.98 v96.01,66.03 | 22.55,12.64 21.28,13.91
  Route2 0.61: v45.79,46.55 48.2,48.96 v50.43,48.96 | v14.29,10.73 v22.55,10.73 22.55,12.64 | 21.28,13.91 v21.28,19.62 22.87,19.62 24.14,20.89 24.14,23.43 26.36,25.65 | v20.64,28.19 23.82,28.19 26.36,25.65 | 26.36,25.65 27,25.02 32.71,25.02 v36.84,20.89
  Route15 0.254: v39.31,58.17 39.44,58.17 | v32.39,63.88 32.46,63.88
  Route15 0.305: v46.83,66.27 46.81,66.29 | v71.57,64.77 71.64,64.77 | v62.68,69.53 62.55,69.66
  Route15 0.61: 96.53,64.39 96.53,65.51 v96.01,66.03
  Bottom 0.305: v58.87,43.12 v58.88,43.12 61.6,43.12 63.83,45.34 64.78,45.34 69.22,40.89 69.22,39.5 v69.41,39.31
  Bottom 0.406: SJ2.1 21.53,10.1 22.17,10.73 v22.55,10.73 | SJ3.1 69.22,40.89
  Bottom 0.61: SJ1.1 14.73,10.29 v14.29,10.73
  other vias: 83.71,48.39 82.94,47.94 83.19,45.09 84.15,44.39
  pour Route15 (rank 6): 106.28,75.03 106.28,-0.97 -0.99,-0.97 -0.99,75.53
  pour Top (isolate 0.254, rank 2, no thermals): 77.16,43.12 79.7,43.12 81.92,45.34 81.92,48.2 82.56,48.83 96.53,48.83 96.53,31.37 81.29,31.37 81.41,38.93 79.81,40.53 77.16,40.58 76.84,40.89 76.84,42.8
5V  (via drill 0.6)
  Top 0.406: v75.26,38.67 C64.A | C76.1 95.57,42.16 93.04,44.7 IC13.3
  Top 0.61: C84.+ 92.58,38.21 93.88,39.52 C76.1
  Top 0.813: 92.84,42.04 91.45,43.43 IC13.3 90.18,44.7 88.27,46.61 88.27,51.05 90.81,53.59 93.35,53.59 93.99,54.23 93.99,58.04 94.62,58.67 97.16,58.67 100.34,61.85 D2.C
  Route2 0.61: v53.76,19.03 60.51,25.78 76.76,25.78 80.26,29.28 80.26,33.74 v80.05,33.94
  Route15 0.813: v80.05,33.94 80.05,38 | 80.05,38 80.02,38.04 | 80.05,38 80.05,38.39 80.65,38.99 88.27,38.99 90.81,41.53 90.81,44.07 IC13.3
  Bottom 0.254: 16.76,13.53 16.64,13.42 16.64,11.49
  Bottom 0.406: 16.64,9.01 19.76,9.01 SJ2.3 | SJ3.3 73.03,40.89 v75.26,38.67
  Bottom 0.61: v53.76,19.03 52.26,19.03 50.76,20.53 40.01,20.53 37.51,18.03 24.51,18.03 21.26,14.78 18.01,14.78 16.76,13.53 | 16.64,11.49 16.64,9.01 SJ1.3
  pour Top (isolate 0.254, rank 3, no thermals): 81.01,33.03 81.01,39.28 79.76,40.53 74.01,40.53 74.01,36.28 77.01,33.03
  pour Top: 98.43,64.39 102.24,64.39 102.88,63.75 102.88,60.26 102.24,59.63 98.43,59.63 97.8,60.26 97.8,63.75
  pour Top: 89.86,45.66 92.72,45.66 96.21,42.16 96.21,38.35 92.08,38.35 88.91,41.53 88.91,44.7
12VREG  (via drill 0.6)
  Top 0.254: IC14.6 70.35,23.88 70.03,23.55 C66.1
  Top 0.406: IC11.1 67.06,19.84 | C62.1 67.06,19.84 | C66.1 70.03,20.47 69.68,20.12 | 69.68,20.12 69.4,19.84 67.06,19.84 | C75.1 111.55,35.5 110.92,34.86 IC15.6 | v71.13,19.62 70.18,19.62 69.68,20.12
  Top 0.61: C75.1 109.86,37.4 v109.54,37.72
  Route15 0.61: v71.13,19.62 71.45,19.62 78.75,26.92 78.75,27.24 79.07,27.56 79.38,27.56 81.29,29.46 91.45,29.46 94.3,26.61 106.69,26.61 109.86,29.78 109.86,37.4 v109.54,37.72
+5V
  pour Top: 120.66,63.12 115.9,63.12 114.63,64.39 104.47,64.39 103.83,63.75 103.83,60.26 104.47,59.63 114.94,59.63 115.58,60.26 120.66,60.26 120.98,60.58 120.98,62.8
AGND  (via drill 0.6)
  Top 0.254: C6.2 45.61,36.34 v46.71,37.43 46.71,37.79 IC1.15 48.59,39.67 48.59,40.32 47.82,41.09 47.17,41.09 IC1.11
  Top 0.406: C21.C SL1.1 | C22.C 5.78,78.11 5.28,78.61 SL1.3 | C23.C 5.72,72.52 4.71,73.53 SL1.5 | C24.C 9.54,67.24 9.09,67.69 3.56,67.69 SL1.7
  Route15 0.254: v46.71,37.43 46.71,43.08 47.51,43.88 47.51,54.83 43.51,58.83 43.51,60.33 37.81,66.03 7.51,66.03 5.08,68.45 SL1.7
  pour Route2 (isolate 0.254): -0.89,88.7 -0.89,63.83 8.41,63.83 8.41,88.7
  pour Route2 (isolate 0.254, no thermals): 51.44,44.39 48.9,41.85 48.9,37.4 47.63,36.13 46.05,36.13 45.41,36.77 45.41,39.94 43.82,41.53 43.82,41.85 45.41,43.43 45.41,45.34 47.95,47.88
AVCC  (via drill 0.6)
  Top 0.254: L1.1 43.89,39.44 44.82,39.44 | 44.82,39.44 IC1.10 | IC1.12 46.24,39.44 44.82,39.44 | v43.01,36.23 43.01,38.55 L1.1 | v11.91,64.13 11.91,65.18 RN1.1 RN1.2 RN1.3 RN1.4 | C6.1 43.11,38.57 L1.1
  Route2 0.254: v11.91,64.13 11.91,64.55 8.26,68.2 8.26,85.34 6.99,86.61 JP35.1
  Route15 0.254: v11.91,64.13 13.31,65.53 37.21,65.53 42.91,59.83 42.91,58.33 46.91,54.33 46.91,49.13 43.81,46.03 43.81,37.03 v43.01,36.23
DIR1  (via drill 0.6)
  Top 0.254: IC1.80 49.01,54.57 49.01,56.28 45.28,60.01 v45.03,60.01 | JP7.2 27.76,70.42 v28.77,70.42
  Top 0.305: v24.39,85.03 24.14,85.28 24.14,85.34 23.95,85.53 18.23,85.53 18.05,85.35 IC2.P14
  Route2 0.254: v45.03,60.01 36.96,68.07 30.61,68.07 28.77,69.91 v28.77,70.42
  Route15 0.254: v24.39,85.03 25.51,83.91 25.51,75.28 JP7.2
DIR2  (via drill 0.6)
  Top 0.254: JP9.2 49.99,74.55 51.01,73.53 51.01,68.53 50.01,67.53 50.01,65.76 v52.14,63.63 | v57.79,46.23 59.62,44.4 61.3,44.4 IC1.49
  Top 0.305: IC3.P14 43.7,85.22 44.08,85.6 45.79,85.6 v46.3,85.09
  Route15 0.305: v46.3,85.09 49.92,85.09 51.95,83.06 51.95,75.95 50.55,74.55 JP9.2
  Bottom 0.254: v57.79,46.23 57.35,46.23 56.33,47.24 55.82,47.24 52.71,50.36 52.71,52.83 54.62,54.74 54.62,61.15 52.33,63.44
  Bottom 0.305: 52.33,63.44 v52.14,63.63
DIR3  (via drill 0.6)
  Top 0.254: IC1.58 59.07,48.03 58.26,48.03 57.76,48.53 56.76,48.53 56.42,48.2 v56.2,48.2 | 70.75,60.13 70.75,57.79 v70.11,57.15
  Top 0.305: IC5.P14 69.29,85.28 69.54,85.53 71.38,85.53 v71.95,84.96 | 70.75,60.13 76.84,66.23 76.84,72.33 75.64,73.53 JP12.2
  Route15 0.305: v71.95,84.96 75.64,84.96 77.29,83.31 77.29,75.31 JP12.2
  Bottom 0.254: 57.67,49.47 56.4,48.2 v56.2,48.2
  Bottom 0.305: 75.64,73.53 JP12.2 | 57.67,49.47 65.79,49.47 68.33,52.01 68.33,55.94 69.54,57.15 v70.11,57.15
DIR4  (via drill 0.6)
  Top 0.254: IC1.56 59.03,46.58 v58.99,46.58 | 72.08,57.72 72.08,56.45 v71.83,56.2
  Top 0.305: 72.08,57.72 72.08,59.56 78.81,66.29 78.81,70.36 JP15.2 | 95.96,85.6 95.89,85.66 94.81,85.66 94.5,85.35 IC6.P14 94.5,85.28 94.81,85.6 95.96,85.6 | 95.96,85.6 96.21,85.34 v96.21,83.31
  Route15 0.305: JP15.2 80.72,71.69 81.29,72.26 81.29,75.25 80.84,75.69 79.7,75.69 78.68,76.71 78.68,83.38 79.57,84.27 85.41,84.27 85.61,84.07 87.19,84.07 88.34,85.22 94.3,85.22 v96.21,83.31
  Bottom 0.254: v71.83,56.2 69.48,53.85 69.48,51.44 66.3,48.26 60.67,48.26 v58.99,46.58
DIR5  (via drill 0.6)
  Top 0.254: IC1.50 64.05,45.59 v65.98,45.59
  Top 0.305: IC12.P14 118.32,84.91 118.75,85.34 121.29,85.34 v121.93,84.71
  Route2 0.305: v90.81,71.37 83.19,71.37 81.6,72.96 81.6,74.87 80.97,75.5 77.79,75.5 75.89,77.41 75.26,77.41 73.35,75.5 60.02,75.5 57.16,72.64 55.57,72.64 54.11,71.18 v54.11,65.15
  Route2 0.457: v121.93,84.71 121.93,73.6 120.98,72.64 114.94,72.64 114.63,72.96 113.35,72.96 113.04,72.64 JP18.2
  Route15 0.254: v54.11,65.15 55.89,65.15 56.52,64.51 56.52,58.48 56.97,58.04 56.97,53.09 59.38,50.67 62.43,50.67 65.98,47.12 v65.98,45.59
  Route15 0.305: JP18.2 105.1,70.74 91.45,70.74 v90.81,71.37
EN1  (via drill 0.6)
  Top 0.254: v44.14,62.36 44.08,62.29 44.08,59.44 44.9,58.61 45.93,58.61 48.51,56.03 48.51,54.37 IC1.81 | v29.92,69.98 29.92,70.8 JP7.1
  Top 0.305: IC2.P23 12.2,85.22 11.95,85.47 10.74,85.47 v10.29,85.03
  Route2 0.254: v44.14,62.36 43.48,62.36 37.14,68.69 31.2,68.69 v29.92,69.98
  Route15 0.305: v10.29,85.03 10.29,85.34 10.42,85.47 22.36,85.47 24.58,83.25 24.58,77.28
  Route15 0.406: 24.58,77.28 24.58,76.52 JP7.1
EN2  (via drill 0.6)
  Top 0.254: JP9.1 50.45,77.09 51.76,75.78 51.76,66.8 v51.19,66.23 | v57.86,44.58 58.71,44.58 59.38,43.9 61.09,43.9 IC1.48
  Top 0.305: IC3.P23 37.85,85.16 37.54,85.47 36.77,85.47 v36.01,84.71
  Route15 0.254: 51.19,77.85 50.43,77.09 JP9.1
  Route15 0.305: v36.01,84.71 36.01,85.09 36.33,85.41 44.58,85.41 45.92,84.07 49.85,84.07 51.19,82.74 51.19,77.85
  Bottom 0.254: v51.19,66.23 51.19,62.99 54.05,60.13 54.05,55.05 52.14,53.15 52.14,50.04 55.44,46.74 55.95,46.74 57.86,44.83 v57.86,44.58
EN3  (via drill 0.6)
  Top 0.254: IC1.59 58.86,48.53 58.51,48.53 57.44,49.59 v56.4,49.59 | v73.48,64.39 73.48,64.25 70.19,60.96 70.19,59.45 v68.65,57.91 | IC5.P23 63.44,85.1 63.01,85.53 61.66,85.53 v61.6,85.47
  Route15 0.254: v61.6,85.47 62.04,85.47
  Route15 0.305: 62.04,85.47 69.98,85.47 71.51,83.95 73.03,83.95 73.35,84.27 75.32,84.27 76.46,83.12 76.46,77.02 JP12.1
  Bottom 0.254: v68.65,57.91 67.76,57.02 67.76,52.2 65.6,50.04 56.84,50.04 v56.4,49.59
  Bottom 0.305: JP12.1 75.51,76.03 73.92,74.44 73.92,64.83 v73.48,64.39
EN4  (via drill 0.6)
  Top 0.254: IC1.57 59.28,47.53 57.44,47.53 v57.35,47.62 | v69.67,55.44 71.32,57.09 71.32,59.82
  Top 0.305: IC6.P23 88.65,85.22 88.34,85.53 87,85.53 v86.49,85.03 | 71.32,59.82 77.73,66.23 77.73,73.28 78.68,74.23 JP15.1
  Route15 0.305: v86.49,85.03 79.38,85.03 77.99,83.63 77.99,76.39 JP15.1
  Bottom 0.254: v57.35,47.62 57.35,47.94 58.24,48.83 66.11,48.83 68.9,51.62 68.9,54.67 v69.67,55.44
EN5  (via drill 0.6)
  Top 0.254: IC1.85 48.29,51.73 48.9,51.12 48.9,49.09 50.81,47.18 50.81,45.85 55.25,41.4 56.08,41.4 56.46,41.78 56.46,43.12 55.76,43.82 54.55,43.82 52.33,46.04 52.33,53.47 52.71,53.85 52.71,55.88 51.7,56.9 v51.7,58.99
  Top 0.305: IC12.P23 112.47,84.96 112.09,85.34 109.86,85.34 v109.23,84.71
  Route2 0.305: JP18.1 105.74,75.18 105.1,74.55 105.1,71.37 104.46,70.74 91.76,70.74 91.45,70.42 90.18,70.42 89.86,70.74 82.88,70.74 80.65,72.96 77.79,72.96 75.89,74.87 61.92,74.87 55.25,68.2 55.25,63.56 v54.68,62.99
  Route2 0.457: v109.23,84.71 107.01,82.49 JP18.1
  Route15 0.254: v51.7,58.99 51.7,60.01 v54.68,62.99
ENET_CRS
  Top 0.254: IC1.92 42.31,52.79 42.31,55.73 41.01,57.03 R60.2
ENET_MDC  (via drill 0.6)
  Top 0.254: IC8.13 31.48,56.37 31.69,56.58 v32.52,56.58 | IC1.87 48.31,50.32 48.31,48.41 v48.97,47.75
  Bottom 0.254: v32.52,56.58 32.96,56.58 33.34,56.2 33.34,51.12 37.54,46.93 41.73,46.93 42.55,47.75 v48.97,47.75
ENET_MDIO  (via drill 0.6)
  Top 0.254: IC8.12 33.01,55.35 35,57.34 35,58.04 35.57,58.61 36.14,58.61 36.2,58.55 36.33,58.55 36.27,58.61 R52.1 36.2,58.61 36.2,59.37 36.46,59.63 v39.95,59.63 | v42.04,58.74 42.11,58.74 43.19,57.66 43.95,57.66 45.28,56.32 45.28,55.5 46.87,53.91 46.87,52.47 IC1.86
  Bottom 0.254: v42.04,58.74 41.16,59.63 v39.95,59.63
ENET_REF_CLK
  Top 0.254: IC1.88 46.3,51.62 46.3,53.59 44.71,55.18 44.71,56.13 43.76,57.09 42.3,57.09 41.09,58.29 41.09,59.82 40.27,60.64 R51.2
ENET_RX_ER  (via drill 0.6)
  Top 0.254: IC1.89 45.79,51.43 45.79,53.21 43.51,55.5 v43.51,55.88 | IC8.10 v34.67,54.35 v34.68,54.36 35.82,55.5 R53.1
  Bottom 0.254: v34.68,54.36 36.46,52.58 40.01,52.58 43.31,55.88 v43.51,55.88
ENET_RXD0  (via drill 0.6)
  Top 0.254: R58.2 39.12,49.91 v39.25,49.78 | v43.44,53.28 43.44,52.36 IC1.91
  Bottom 0.254: v39.25,49.78 39.95,49.78 v43.44,53.28
ENET_RXD1  (via drill 0.6)
  Top 0.254: 39.89,48.13 v39.5,48.13 39.25,48.39 R59.2 | v44.84,52.52 44.84,51.67 IC1.90
  Bottom 0.254: v44.84,52.52 44.46,52.52 40.08,48.13 v39.5,48.13
ENET_TX_EN  (via drill 0.6)
  Top 0.254: v41.28,55.5 41.41,55.37 41.41,52.98 IC1.93 | IC8.16 29.98,57.4 28.71,58.67 v28.71,59.44
  Bottom 0.254: v41.28,55.5 41.28,55.88 40.58,56.58 35.95,56.58 33.66,58.86 29.28,58.86 v28.71,59.44
ENET_TXD0  (via drill 0.6)
  Top 0.254: v39.63,53.85 40.27,53.21 40.27,52.71 IC1.95 | IC8.17 29.48,56.69 28.57,57.61 v28.4,57.61
  Bottom 0.254: v39.63,53.85 36.9,53.85 33.09,57.66 28.46,57.66 v28.4,57.61 28.39,57.6
ENET_TXD1  (via drill 0.6)
  Top 0.254: v39.7,55.5 40.84,54.36 40.84,52.84 IC1.94 | IC8.18 28.55,56.1 v26.93,57.72
  Bottom 0.254: v39.7,55.5 36.2,55.5 33.41,58.29 29.03,58.29 28.77,58.55 27.76,58.55 v26.93,57.72
ETA_CURRENT  (via drill 0.6)
  Top 0.305: IC9.2 87.77,58.17 v87.64,58.04
  Route15 0.305: v87.64,58.04 87,58.04 86.37,58.67 84.78,58.67 83.83,57.72 82.56,57.72 JP34.3
GND  (via drill 0.6, 0.6 pad 1.02)
  Top 0.254: C14.1 58.68,57.47 57.73,57.47 56.59,56.32 56.59,55.45 IC1.72 | 60.23,58.45 IC4.13 60.23,61.18 v60.59,61.53 61.94,61.53 62.18,61.29 | IC1.41 59.25,40.77 | 59.25,40.77 60.97,39.05 61.48,39.05 62.55,37.97 63.95,37.97 C9.1 | C10.1 58.62,33.02 58.62,34.04 58.62,34.35 56.84,36.13 56.84,36.14 IC1.31 | IC1.55 | 44.05,47.52 IC1.97 43.36,48.2 43.19,48.2 43,48.01 v41.28,48.01 40.58,48.71 40.58,50.1 40.9,50.42 C11.1 | IC4.3 IC4.4 62.81,65.95 62.81,64.77 62.62,64.58 61.03,64.58 60.88,64.73 IC4.7 IC4.8 | IC4.16 62.18,61.29 | 62.18,61.29 62.49,61.6 63.19,61.6 63.51,61.28 63.51,60.16 IC4.18 | 59.25,40.77 57.73,42.29 v57.73,42.67 | C8.1 66.23,49.66 65.67,49.66 65.03,49.02 62.18,49.02 IC1.55 | 60.27,57.28 61.67,57.28 JP3.3 | C12.1 47.38,55.56 | C12.1 | C12.1 47.31,55.5 47.91,54.9 47.91,53.55 IC1.83 50.49,50.97 v50.49,50.42 | 45.41,32.13 45.39,32.13 C2.2 | C3.2 46.81,30.23 | IC14.3 66.39,23.86 69.22,23.86 | C38.2 70.94,74.36 | C54.2 24.01,45.59 v25.15,44.45 | C52.2 26.17,43.43 v25.15,44.45 | v30.74,47.43 30.46,47.16 R62.1 | C45.C 28.92,42.1 | v26.04,46.1 R63.1 26.11,47.22 C46.2 | v25.15,44.45 24.23,43.52 C55.2 | IC7.3 33.98,60.56 33.26,61.28 31.51,61.28 31.09,61.7 C44.2 29.06,63.13 24.13,63.13 JP6.3 | C59.2 32.14,42.27 | R50.1 24.1,32.13 C56.2 | C31.1 67.79,61.3 v68.97,62.48 | C25.2 17.53,69.15 v16.51,70.17 | 45.35,32.07 43.75,32.07 C13.1 | IC1.55 60.14,46.98 v60.14,45.85 | IC11.2@1 64.16,17.09 | 69.22,23.86 v69.22,24.7 | C66.2 68.33,21.27 69.22,22.16 69.22,23.86 | R74.2 78.41,26.59 78.43,26.61 v79.7,26.61 | R90.2 68.96,18.35 | C78.2 30.8,35.81 v30.49,36.13 | C79.2 35.88,35.18 v34.93,36.13 | v32.39,27.24 31.76,27.88 31.76,30.1 31.97,30.31 C82.2
  Top 0.254: v36.84,27.24 36.84,29.78 37.37,30.31 C83.2 | v44.35,35.11 44.39,35.11 45.41,36.13
  Top 0.305: C25.2 17.94,69.15 R26.2 | C15.1 v9.21,71.5 | 31.69,92.33 R34.1 31.75,91.75 31.69,91.69 | 59,57.21 C14.1 59.1,57.31 60.23,57.31 | 60.23,58.45 60.23,57.31 | 60.23,57.31 60.27,57.28 | v46.3,70.99 R27.2 | IC4.8 60.78,65.97 60.84,65.91 | 60.84,65.91 60.84,66.04 | 60.84,65.91 60.84,64.58 v60.52,64.26 | 58.62,34.04 58.62,32.96 58.24,32.58 58.24,27.3 57.48,26.54 | C2.2 46.45,32.17 46.81,31.81 46.81,30.23 | v45.35,30.61 45.35,32.07 45.41,32.13 | S2.4 S2.3 | S1.4 S1.3 | Q9.3 90.43,27.23 R76.2 | Q8.3 80.95,27.34 | v71.76,72.01 71.45,72.33 71.45,73.44 C38.2
  Top 0.406: IC2.P24 | LED10.C LED9.C LED4.C LED3.C LED2.C LED1.C | 40.9,50.42 40.9,50.48 39.57,51.82 C50.C 37.94,52.87 C51.2 | 1.47,49.4 U1.GND1 | 15.12,81.22 15.18,81.15 | C47.2 24.46,54.36 23.63,53.53 v22.8,53.53 22.8,53.09 21.72,52.01 21.32,52.01 C1.1 | C33.1 83.83,72.26 | 10.01,89.03 v9.01,90.03 9.26,90.03 | 9.26,90.03 10.01,89.28 | 10.51,89.28 9.76,90.03 9.26,90.03 | C30.2 36.11,89.12 v35.25,89.98 | C28.2 45.98,74.87 v46.43,74.42 | C32.1 58.66,70.93 58.51,70.78 | Q7.S 44.71,15.11 S1.4 | IC11.2@1 IC11.2 | 64.16,17.09 C62.2 | v48.9,66.29 48.9,67.56 | R86.2 v126.37,18.67 | C40.2 85.51,90.1 v85.51,90.2 | C76.2 95.36,38.04 95.26,38.04 95.57,37.72 v95.57,36.45 | v49.09,19.05 49.09,19.62 | 49.09,19.62 49.09,20.57 49.73,21.21 R72.1 | R91.2 49.09,19.62
  Top 0.61: 85.84,89.88 v85.51,90.2 | C43.2 60.84,89.79 60.84,90.3 60.78,90.36 v60.78,90.68 | 79.57,44.09 IC10.1 75.89,44.09 75.26,43.46 C64.C C7.C | S2.3 42.11,17.18 43.86,15.43 Q7.S | 78.11,44.07 78.11,45.34 79.07,45.34 | v111.45,20.26 111.45,21.21 | 111.45,21.21 111.45,21.84 109.23,21.84 v109.23,21.21 111.45,21.21 | 87.64,37.08 C84.- 87.78,35.95 87.64,35.81 | 87.64,35.81 87.16,35.81 v87,35.66 | 87.64,35.81 88.27,35.81 v88.43,35.66 | C63.- 109.04,22.29 v109.23,22.48
  Top 0.813: C73.2 110.66,89.21 v110.66,89.79 | D4.A 107.32,57.09
  Top 1.676: 106.69,57.09 107.32,57.09 111.45,57.09 | 111.45,57.09 111.45,52.01 | 111.45,57.09 115.26,57.09 116.21,58.04 120.66,58.04
  Top 2.54: IC2.EPAD 15.18,81.15
  Route2 0.254: v30.74,47.43 30.36,47.43
  Route2 0.406: v22.8,53.53 22.68,53.4 | 75.13,17.34 75.19,17.4
  Route15 0.406: Q5.S 117.8,17.08 119.39,18.67 v126.37,18.67
  Route15 0.813: v78.01,33.03 76.98,32 JP10.1
  other vias: 94.88,81.72 94.88,80.52 93.16,81.98 93.16,80.39 91.57,81.98 89.99,81.98 91.57,80.39 30.23,54.1 89.23,27.88 97.8,67.25 59.25,30.67 30.61,102.68 30.61,100.58 25.79,102.81 25.73,100.33 55.51,103.12 55.51,100.9 51.76,103.06 51.76,100.96 83.51,72.64 103.07,96.52 103,94.04 103,91.76 101.29,96.52 89.99,80.39 88.46,81.85 88.46,80.52 87,82.68 87,81.22 87,79.82 85.54,82.68 85.54,81.15 85.61,79.76 83.95,82.68 83.95,80.9 83.95,79.31 83.95,77.72 96.97,81.53 97.8,80.64 97.8,79.44 67.95,81.98 67.95,80.33 66.37,81.98 66.37,80.33 64.84,81.98 64.84,80.33 63.13,80.52 69.6,80.39 69.6,81.79 71.7,82.55 71.76,80.96 71.76,79.57 73.29,82.55 73.29,81.03 73.29,79.57 73.29,78.1 73.29,76.71 74.81,82.55 74.81,81.09 74.81,79.63 74.81,78.17 63.13,81.79 59.7,77.22 61.16,83.44 61.16,82.04 61.16,80.58 61.16,79.12 61.16,77.6 59.63,84.39 59.63,82.99 59.63,81.6 59.7,80.14 59.7,78.68 56.4,84.2 56.4,82.11 56.4,80.07 54.55,84.2 54.55,82.11 54.55,80.07 56.33,78.3 54.55,78.36 52.97,84.14 52.97,82.11 52.97,80.07 53.09,78.55 40.77,81.98 40.77,80.26 39.25,81.98 39.25,80.26 42.3,82.04 42.3,80.33 43.95,81.98 43.95,80.33 37.41,82.04 37.47,80.39 35.95,83.12 35.95,81.41 35.95,79.63 35.89,77.91 34.42,85.09 34.42,82.8 34.42,81.15 34.49,79.5 34.49,77.79 32.27,83.38 32.9,82.3 32.9,80.71 32.96,78.99 30.49,83.69 29.85,82.49 29.85,80.71 29.85,78.93 29.85,75.25 28.9,83.63 28.33,82.49 28.33,80.71 28.33,78.93 27.44,83.69 26.87,82.49 26.8,80.77 26.74,78.93 15.12,81.98 15.12,80.33 13.66,81.98 13.66,80.33 11.88,82.11 11.95,80.33 10.49,82.99 10.49,81.6 10.49,80.14 9.91,78.8 9.15,82.99 9.15,81.6 16.64,81.98 16.64,80.33 18.36,82.04 18.36,80.26 20.26,83.95 20.26,82.49 20.26,81.03 20.26,79.57 20.26,78.17 21.66,83.95 21.66,82.55 21.72,81.09 21.72,79.57 23.06,82.55 23.06,81.15 23.06,79.82 45.85,82.49 45.85,80.96 45.85,79.44 47.44,82.49 47.44,81.03 47.44,79.57 49.03,82.49 49.03,81.03 49.03,79.69 4.58,97.03 3.06,96.39 4.64,89.09 3.37,94.93 2.74,92.65 2.93,89.03 4.9,94.93 4.9,99.06 2.8,97.98 2.8,90.61 82.37,82.68 82.37,80.9 82.37,79.31 82.37,77.66 80.78,82.68 80.78,80.96 80.78,79.31 80.78,77.66 80.51,102.53 80.51,100.53 76.51,100.53 76.51,102.53 89.23,25.34 3.11,59.54 3.11,58.29 3.11,60.79 17.47,56.45 16.2,52.64 18.11,60.58 19.06,32 17.47,33.27 14.61,36.45 12.39,38.67 14.61,41.21 20.11,43.79 40.17,38.23 25.66,29.41 28.32,40.54 113.51,80.9 117.32,80.9 116.69,81.85 115.42,81.85 114.15,81.85 114.15,79.95 115.42,79.95 116.69,79.95 112.88,79.95 112.88,81.85 117.96,81.85 117.96,79.95 118.59,80.9 119.23,81.85 119.23,79.95 119.86,80.9 112.24,80.9 111.61,81.85 111.61,79.95 110.97,80.9 110.34,81.85 110.34,79.95 120.5,81.85 120.5,79.95 105.26,92.33 105.26,93.6 105.26,91.06 106.53,94.87 107.8,94.87 106.53,89.79 107.8,89.79 125.58,92.33 125.58,93.6 124.63,94.87 123.36,94.87 123.36,89.79 124.63,89.79 125.58,91.06 106.37,24.07 104.78,20.89 106.37,20.89 89.23,26.61 104.78,24.07 80.97,25.34 79.7,25.34 90.5,25.34 66.05,15.81 6.04,25.65 6.04,23.43 6.04,21.21 6.04,18.99 21.6,26.29 21.28,21.21 17.47,16.45 30.97,42.04 3.5,44.07 3.5,41.21 3.5,38.67 3.5,36.13 3.5,33.59 6.04,38.67 8.9,38.67 4.14,49.47 2.55,52.01 7.95,53.91 9.53,60.58 22.71,70.14 81.92,54.23 81.92,52.32 81.92,50.42 83.19,56.77 78.43,61.85 91.45,52.01 95.89,50.74 95.26,54.86 91.45,55.5 88.27,52.96 95.26,57.4 95.26,60.26 95.26,63.44 104.63,78.23 100.82,79.82 14.61,26.61 15.88,19.62 16.2,21.53 15.88,25.65 8.9,25.65 14.3,15.81 6.2,16.96 15.25,49.15 13.66,51.37 9.85,50.1 6.36,51.05 12.39,52.96 2.87,55.18 13.03,61.53 110.18,20.26 109.23,23.75 39.7,36.13 88.91,61.21 87.96,63.12 91.13,63.12 92.08,61.21
  pour Route2 (rank 6): 129.55,105.03 129.55,-1.65 0.01,-1.65 0.01,105.03
  pour Top: 57.48,32.45 57.48,31.69 55.76,29.97 55.76,24.45 56.4,23.81 59,23.81 60.33,25.15 60.33,25.46 59.82,25.97 59.82,32.96 59.06,33.72 58.68,33.72 57.41,32.45
  pour Top: 24.84,99.57 24.84,103.31 25.53,104.01 31.31,104.01 31.95,103.38 31.95,99.63 31.31,99 25.41,99
  pour Top: 50.81,100.65 50.81,103.7 51.44,104.33 56.21,104.33 56.84,103.7 56.84,99.82 56.59,99.57 51.89,99.57
  pour Top (rank 6): 100.02,85.66 100.02,98.36 108.28,98.36 108.28,85.66
  pour Bottom (rank 6): -2.53,107.57 132.09,107.57 132.09,-1.65 -2.53,-1.65
  pour Top (isolate 0.254): -1.09,63.83 -1.09,48.23 21.71,48.23 21.71,63.83
  pour Top (isolate 0.254, no thermals): 91.45,28.51 91.13,28.83 88.59,28.83 88.27,28.51 88.27,24.7 88.59,24.38 91.13,24.38 91.45,24.7
  pour Top (isolate 0.254, rank 6): 132.09,-4.19 132.41,109.47 83.01,109.03 83.01,99.03 74.01,99.03 74.01,109.03 58.01,109.03 58.01,99.03 50.01,99.03 50.01,109.03 33.01,109.03 33.01,98.03 25.01,98.03 25.01,109.03 -3.99,109.03 -3.99,67.03 82.01,67.03 82.01,57.4 78.43,57.4 78.43,42.8 81.92,42.8 81.92,-4.19
  pour Route2 (isolate 0.254, rank 6, no thermals): 109.01,-4.97 109.01,26.03 60.01,26.03 53.01,19.03 44.01,19.03 43.01,18.03 43.01,-4.97
  pour Route15 (isolate 0.254, rank 2, no thermals): 71.76,16.13 71.76,11.37 67.64,7.24 67.64,3.43 66.68,2.48 64.46,2.48 63.83,3.11 63.83,10.73 69.54,16.76 71.13,16.76
  pour Top (isolate 0.254): -0.74,30.03 -0.74,14.28 24.01,14.28 24.01,25.78 20.26,30.03 15.26,30.03 14.01,28.78 12.51,28.78 11.26,30.03
  pour Top (isolate 0.254): -0.99,30.53 20.31,30.53 24.46,25.97 40.01,25.97 41.28,27.24 41.21,40.33 40.33,41.21 40.26,47.53 -0.99,47.53
  pour Top (rank 6): 83.01,109.03 74.01,109.03 74.01,100.03 75.01,99.03 82.01,99.03 83.01,100.03
  pour Top (rank 6): 58.01,109.03 50.01,109.03 50.01,99.03 58.01,99.03
  pour Top (rank 6): 33.01,109.03 25.01,109.03 25.01,98.03 33.01,98.03
  pour Top (rank 6): 104.52,73.03 98.37,73.03 98.37,67.03 104.52,67.03
  pour Top (no thermals): 109.23,82.8 122.25,82.8 122.25,78.99 109.23,78.99
  pour Bottom (rank 6): 106.37,64.39 121.61,64.39 122.25,63.75 122.25,43.12 106.37,43.12 105.74,43.75 105.74,63.75
  pour Top (no thermals): 79.38,28.83 81.29,28.83 81.92,28.19 81.92,25.02 81.29,24.38 79.38,24.38 78.75,25.02 78.75,28.19
  pour Bottom (rank 3, no thermals): 109.55,1.21 109.55,10.41 116.53,17.4 118.75,17.4 119.07,17.08 119.07,7.87 112.4,1.21
  pour Route15 (rank 5, no thermals): 132.41,-1.97 132.41,38.99 110.82,38.99 110.82,29.78 106.69,25.65 94.31,25.65 91.13,28.83 84.15,28.83 74.62,19.3 79.38,19.3 79.7,18.99 79.7,-1.97
  pour Top (rank 6): 59.38,19.3 59.38,10.41 60.33,9.46 76.21,9.46 76.21,13.59 72.4,13.59 71.76,14.22 71.76,19.3
  pour Top (rank 6, no thermals): 61.6,19.3 65.73,19.3 65.73,14.22 61.6,14.22
GPIO_FET
  Top 0.254: Q7.G 52.29,17.61 R70.2 R91.1
GPIO_FET1
  Top 0.406: R88.1 R86.1 122.98,15.6 Q5.G
ISP_BOOT  (via drill 0.6)
  Top 0.254: S2.2 v38.3,24.7 | S2.1 38.3,15.96 R15.1 | 38.46,16 R15.1 | IC1.53 60.97,46.4 60.97,45.53 v61.22,45.28 | JP25.3 38.36,16 R15.1
  Top 0.406: S2.2 S2.1
  Route2 0.254: v61.22,45.28 61.22,43.05 59.38,41.21 52.71,41.21 51.12,39.62 51.12,34.86 49.85,33.59 49.85,28.19 48.59,26.92 43.51,26.92 41.6,25.02 38.62,25.02 v38.3,24.7
JTAG-RTCK
  Top 0.254: IC1.100 42.99,46.41 41.6,45.02
  Top 0.711: 40.97,44.39 41.6,45.02
JTAG-TCK
  Top 0.254: IC1.5 43.82,41.98 43.82,40.89 43.51,40.58
  Top 0.711: 42.87,39.94 43.51,40.58
JTAG-TDI
  Top 0.254: IC1.2 42.52,42.8 41.92,42.8 41.6,42.48
  Top 0.711: 41.6,42.48 40.97,41.85
JTAG-TDO
  Top 0.254: IC1.1 41.82,43.98 41.6,43.75
  Top 0.711: 40.97,43.12 41.6,43.75
JTAG-TMS
  Top 0.254: IC1.3 42.28,41.85 42.23,41.85
  Top 0.711: 41.6,41.21 42.23,41.85
JTAG-TRST
  Top 0.254: IC1.4 43.19,42.05 43.19,41.53 42.87,41.21
  Top 0.711: 42.87,41.21 42.23,40.58
LED1
  Top 0.254: R10.2 73.45,46.23 JP29.1 72.33,46.23 70.81,44.7 70.81,42.48 68.27,39.94 68.27,38.55 62.43,32.7 60.98,32.7 IC1.32
LED1/REGOFF  (via drill 0.6)
  Top 0.254: v29.98,50.29 v29.98,50.3 IC8.3
  Route2 0.254: v29.98,50.29 29.53,49.85 22.99,49.85 20.96,47.82 18.29,47.82 11.71,41.23 8.81,41.23 5.34,44.7 RJ1.G+
LED2
  Top 0.254: 72.33,48.71 JP29.2 | JP29.2 74.02,48.77 R11.2 | IC1.33 61.18,33.21 62.17,33.21 67.63,38.67 67.63,40.26 70.18,42.8 70.18,46.93 72.02,48.77 JP29.2
LED2/NINTSEL  (via drill 0.6)
  Top 0.254: v30.74,48.83 30.72,48.86 R62.2 29.01,49.32 29.01,51.03 29.48,51.51 IC8.2
  Route2 0.254: v30.74,48.83 30.49,49.09 23.38,49.09 21.41,47.12 18.55,47.12 11.95,40.51 8.9,40.51 6.93,38.55 6.93,33.72 RJ1.Y+
LED3
  Top 0.254: R12.2 73.39,51.31 JP29.3 72.33,51.31 69.54,48.51 69.54,43.12 67,40.58 67,38.8 62.11,33.91 61.19,33.91 IC1.34
LED4
  Top 0.254: R13.2 72.82,53.85 JP29.4 72.33,53.85 68.9,50.42 68.9,43.43 66.37,40.89 66.37,38.93 62.05,34.61 61.2,34.61 IC1.35
MISO1
  Top 0.254: IC1.61 58.9,50 60.65,51.75 61.03,51.75 62.62,50.17 64.52,50.17 65.73,51.37 JP3.1
MOSFET_DRIVE
  Top 0.254: R67.1 68.18,9.44 U$10.P$2
  Top 0.406: 57.55,20.64 C60.+ 61.85,20.62 62.49,19.99 IC11.3
  pour Bottom (no thermals): 74.83,-0.97 74.83,9.03 72.83,11.03 65.01,11.03 63.76,12.28 61.01,12.28 59.76,11.03 57.01,11.03 56.26,11.78 56.26,19.03 51.26,19.03 51.26,-0.97
  pour Top (isolate 0.254, rank 3, no thermals): 75.2,-0.97 51.51,-0.97 51.51,16.53 53.01,18.03 53.01,19.03 59.01,19.03 59.06,10.1 59.99,9.17 75.06,9.03 75.2,9.03
  pour Route15 (isolate 0.254, rank 3, no thermals): 51.76,-1.02 74.94,-1.02 74.94,9.14 73.03,9.14 71.13,11.05 58.91,11.03 56.89,13.05 56.84,17.72 56.21,18.35 52.4,18.35 51.76,17.72
  pour Top (rank 2): 58.91,19.03 58.91,22.93 54.61,22.93 54.61,19.03
MOSI1
  Top 0.254: IC1.60 60.65,51.03 61.01,51.03 62.51,49.53 64.71,49.53 67.51,52.32 67.51,53.53 66.03,55.01 JP3.2
MS1  (via drill 0.6)
  Top 0.254: 20.9,65.66 17.09,65.66 14.15,68.6 IC2.P05 | v89.67,73.28 90.6,74.21 IC6.P05 | IC12.P05 114.42,72.44 v113.99,72.01
  Top 0.305: 20.9,65.66 21.98,66.74 24.96,66.74 26.17,67.94 v26.74,67.94 26.9,67.79 30.58,67.79 31.31,68.51 32.51,68.51 JP31.2 | IC3.P05 39.8,72.37 37.47,70.04 v37.28,70.04 | 64.4,73.15 v64.33,73.09 65.39,74.15 IC5.P05
  Route15 0.254: v113.99,72.01 109.86,72.01 109.23,72.64 109.23,76.45 108.27,77.41 105.74,77.41 104.78,76.45 104.78,72.64 104.15,72.01 93.04,72.01 91.13,73.91 90.3,73.91 v89.67,73.28 86.68,73.28 83.83,70.42 83.83,64.5 83.27,63.95 78.93,63.95 76.77,66.1 74.68,66.1 67.7,73.09 v64.33,73.09 62.81,73.09 58.74,69.02 51.32,69.02 50.49,68.2 47.85,68.2 45.31,70.74 38.17,70.74 37.82,70.39 37.63,70.39 v37.28,70.04
  Bottom 0.305: v26.74,67.94 29.47,67.94 30.84,69.31 36.52,69.31 37.25,70.04 v37.28,70.04
MS2  (via drill 0.6)
  Top 0.254: v90.88,72.77 90.94,72.77 | 17.34,66.36 20.33,66.36 v21.66,67.69 | IC3.P06 40.45,71.78 v38.62,69.94 | IC12.P06 115.07,71.18 v114.94,71.06
  Top 0.305: IC2.P06 14.8,68.91 17.34,66.36 | v64.65,71.5 64.71,71.5 | v64.65,71.5 64.9,71.75 64.9,71.88 66.04,73.02 IC5.P06 66.04,72.95 64.65,71.56 v64.65,71.5 | IC6.P06 91.25,73.08 90.94,72.77 | JP30.1 37.23,68.56 v38.62,69.94